# Altium project LPL_Control_board_Rev4.PrjPcb (part 1 of 2)
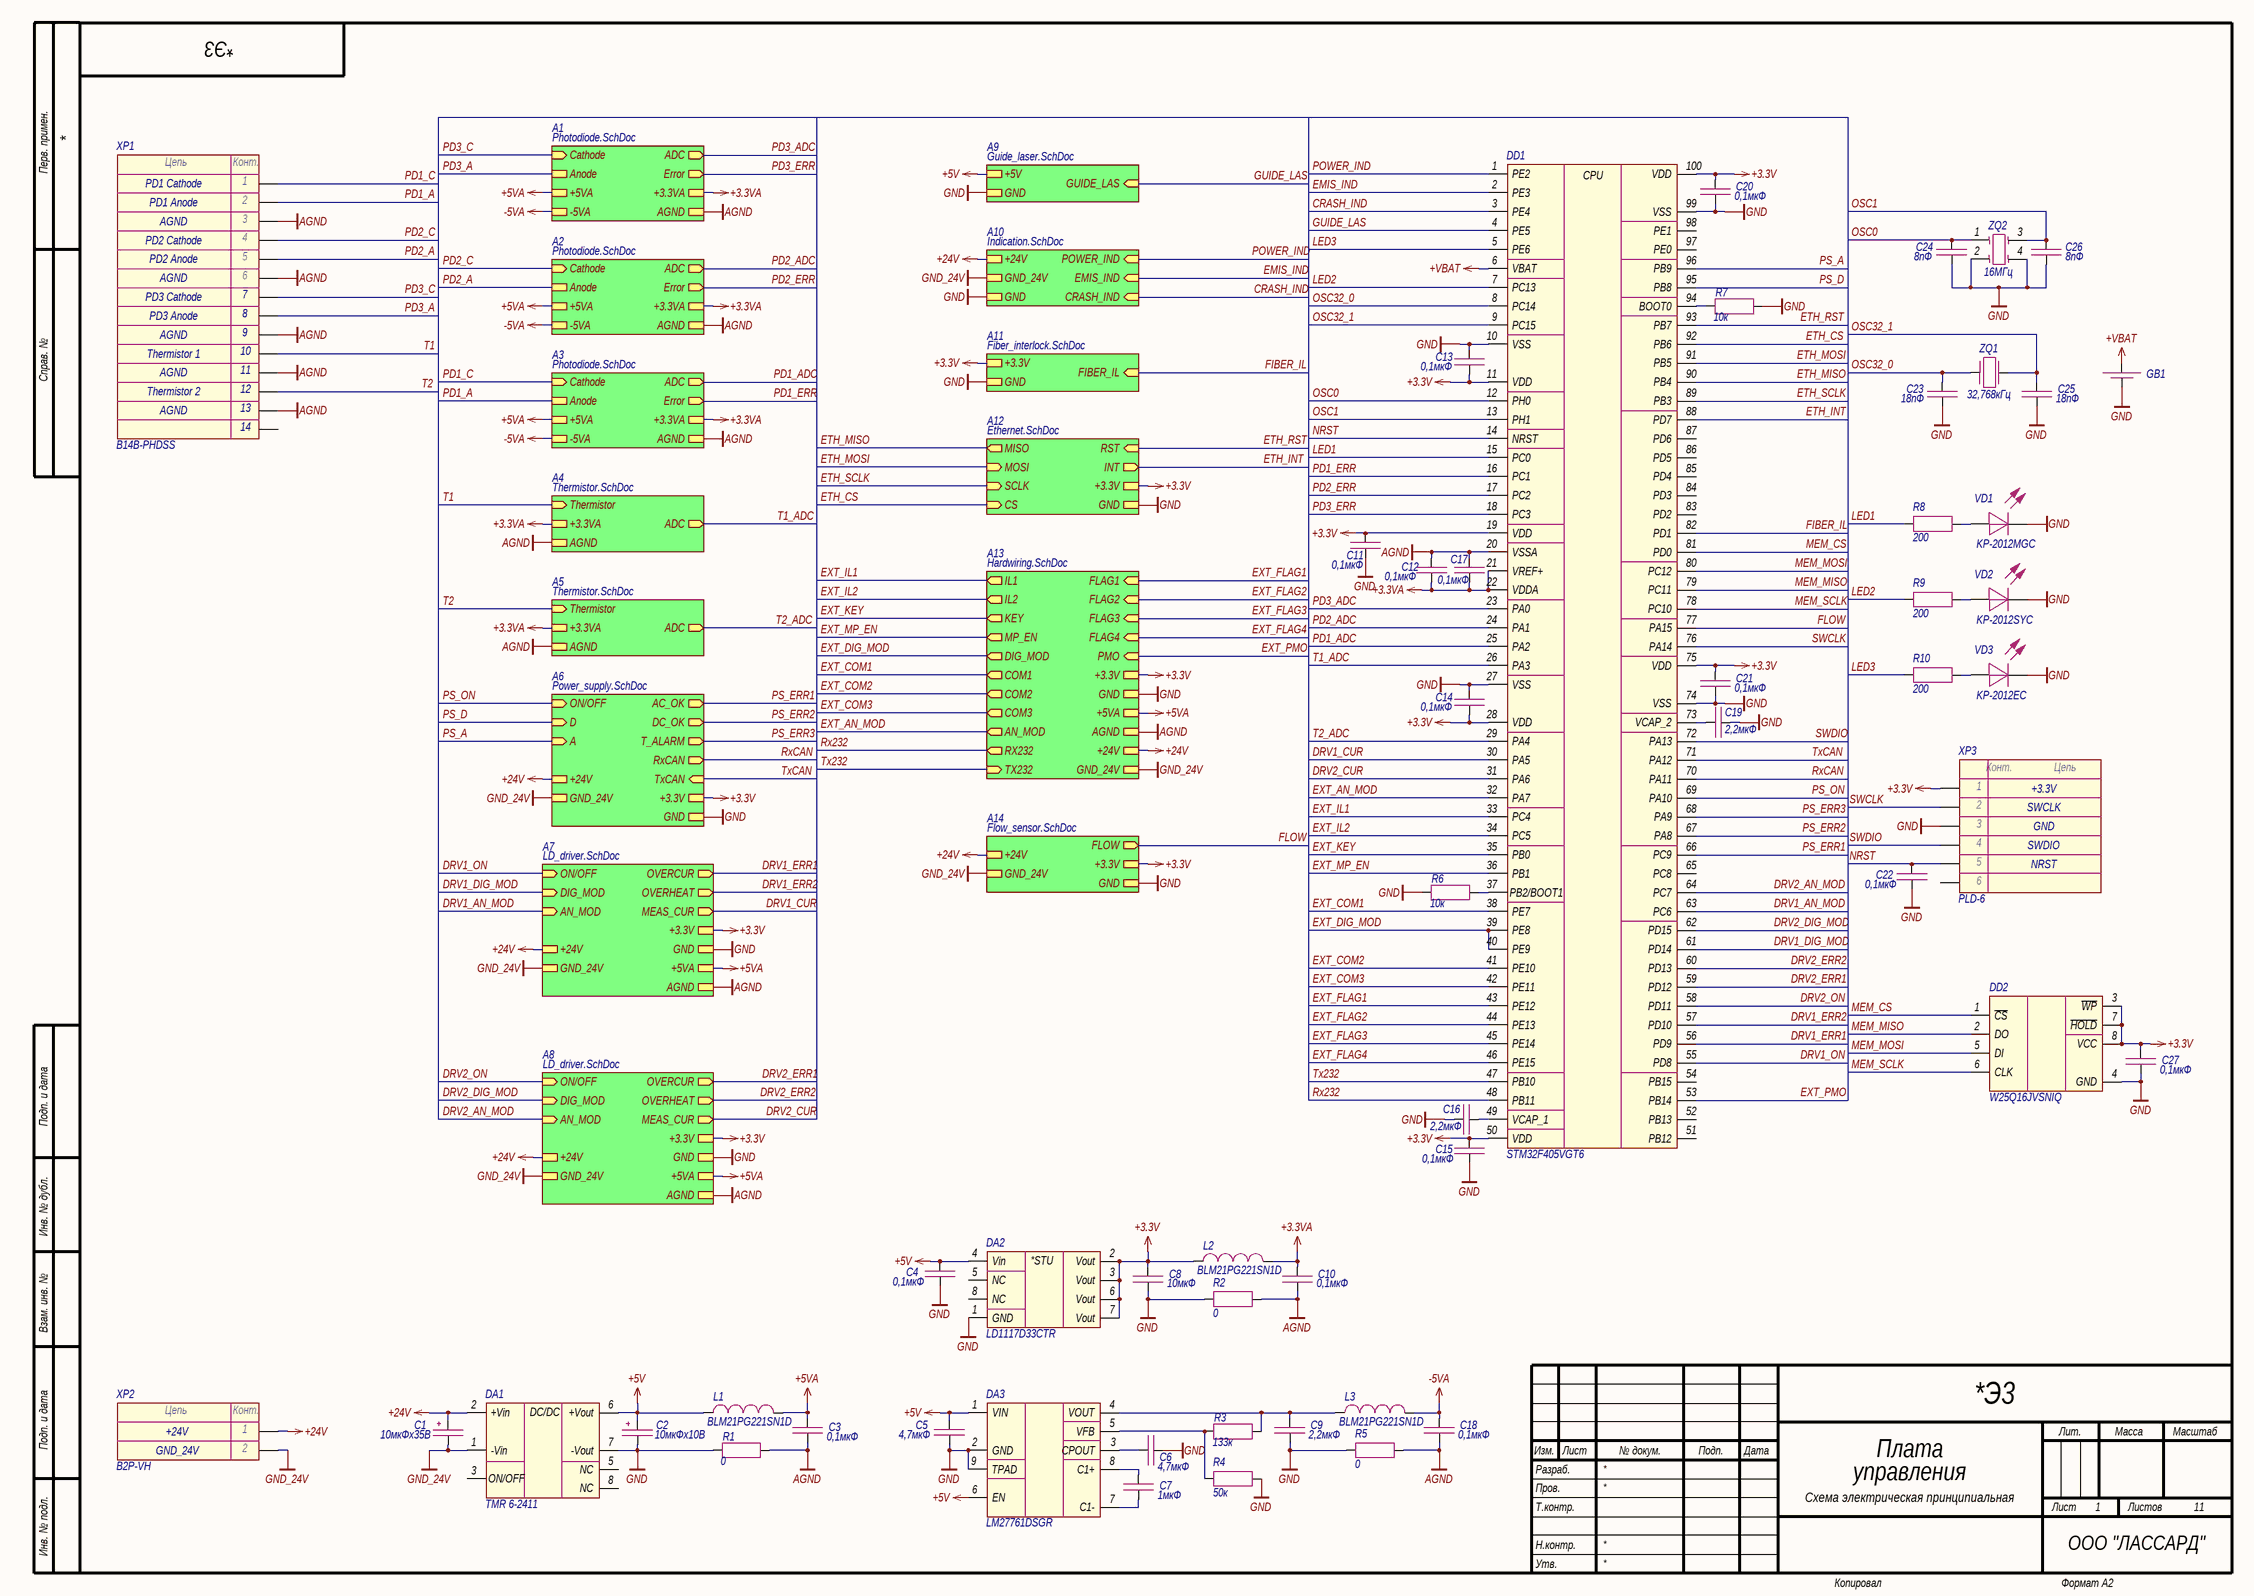
[diagram p0: Main.SchDoc]
11 sheets, 404 parts. Net scope: strictly hierarchical (ports join the sheet entries above them; power ports are local).
Board file: PCB1.PcbDoc
Sheets:
  Main.SchDoc
    A10 = Indication.SchDoc
    A13 = Hardwiring.SchDoc
    A12 = Ethernet.SchDoc
    A1 = Photodiode.SchDoc
    A4 = Thermistor.SchDoc
    A6 = Power_supply.SchDoc
    A7 = LD_driver.SchDoc
    A9 = Guide_laser.SchDoc
    A2 = Photodiode.SchDoc
    A5 = Thermistor.SchDoc
    A11 = Fiber_interlock.SchDoc
    A3 = Photodiode.SchDoc
    A14 = Flow_sensor.SchDoc
    A8 = LD_driver.SchDoc

## Sheet Main.SchDoc: Плата
size 594 x 420 mm; CompanyName: ООО "ЛАССАРД"; Address1: Address1; Address2: Address2; Address3: Address3; Address4: Address4; DocumentNumber: *Э3; SheetNumber: 1; SheetTotal: 11; Title2str: управления; DocumentType: Схема электрическая принципиальная

### Parts
C1  10мкФх35B  [CAP_C]
C2  10мкФх10B  [CAP_A]
C3  0,1мкФ  [CAP_0603]
C4  0,1мкФ  [CAP_0603]
C5  4,7мкФ  [CAP_0603]
C6  4,7мкФ  [CAP_0603]
C7  1мкФ  [CAP_0603]
C8  10мкФ  [CAP_0603]
C9  2,2мкФ  [CAP_0603]
C10  0,1мкФ  [CAP_0603]
C11  0,1мкФ  [CAP_0603]
C12  0,1мкФ  [CAP_0603]
C13  0,1мкФ  [CAP_0603]
C14  0,1мкФ  [CAP_0603]
C15  0,1мкФ  [CAP_0603]
C16  2,2мкФ  [CAP_0603]
C17  0,1мкФ  [CAP_0603]
C18  0,1мкФ  [CAP_0603]
C19  2,2мкФ  [CAP_0603]
C20  0,1мкФ  [CAP_0603]
C21  0,1мкФ  [CAP_0603]
C22  0,1мкФ  [CAP_0603]
C23  18пФ  [CAP_0603]
C24  8пФ  [CAP_0603]
C25  18пФ  [CAP_0603]
C26  8пФ  [CAP_0603]
C27  0,1мкФ  [CAP_0603]
DA1  TMR 6-2411  [TMR3 (SIP-8)]
DA2  LD1117D33CTR  [SOIC-8]
DA3  LM27761DSGR  [WSON-8]
DD1  STM32F405VGT6  [LQFP-100]
DD2  W25Q16JVSNIQ  [SOIC-8]
GB1  DS1092-12-N8S  [DS1092-12-N8S]  (value not drawn)
L1  BLM21PG221SN1D  [IND_0805]
L2  BLM21PG221SN1D  [IND_0805]
L3  BLM21PG221SN1D  [IND_0805]
R1  0  [RES_0805]
R2  0  [RES_0805]
R3  133к  [RES_0603]
R4  50к  [RES_0603]
R5  0  [RES_0805]
R6  10к  [RES_0603]
R7  10к  [RES_0603]
R8  200  [RES_0603]
R9  200  [RES_0603]
R10  200  [RES_0603]
VD1  KP-2012MGC  [LED_0805]
VD2  KP-2012SYC  [LED_0805]
VD3  KP-2012EC  [LED_0805]
XP1  B14B-PHDSS  [B14B-PHDSS]
XP2  B2P-VH  [B2P-VH]
XP3  PLD-6  [PLD-6]
ZQ1  32,768кГц  [NX3215SA]
ZQ2  16МГц  [NX2520SA]

### Sub-sheets
A1 = Photodiode.SchDoc: Cathode (in), ADC (out), Error (out), AGND, +5VA, +3.3VA, -5VA, Anode
A2 = Photodiode.SchDoc: Cathode (in), ADC (out), Error (out), AGND, +5VA, +3.3VA, -5VA, Anode
A3 = Photodiode.SchDoc: Cathode (in), ADC (out), Error (out), AGND, +5VA, +3.3VA, -5VA, Anode
A4 = Thermistor.SchDoc: Thermistor (in), +3.3VA, AGND, ADC (out)
A5 = Thermistor.SchDoc: Thermistor (in), +3.3VA, AGND, ADC (out)
A6 = Power_supply.SchDoc: ON/OFF (in), D (in), +3.3V, GND, +24V, GND_24V, AC_OK (out), DC_OK (out), RxCAN (out), TxCAN (in), T_ALARM (out), A (in)
A7 = LD_driver.SchDoc: +3.3V, GND, OVERCUR (out), OVERHEAT (out), +24V, GND_24V, ON/OFF (in), DIG_MOD (in), AN_MOD (in), MEAS_CUR (out), +5VA, AGND
A8 = LD_driver.SchDoc: +3.3V, GND, OVERCUR (out), OVERHEAT (out), +24V, GND_24V, ON/OFF (in), DIG_MOD (in), AN_MOD (in), MEAS_CUR (out), +5VA, AGND
A9 = Guide_laser.SchDoc: GUIDE_LAS (in), +5V, GND
A10 = Indication.SchDoc: GND_24V, +24V, CRASH_IND (in), POWER_IND (in), EMIS_IND (in), GND
A11 = Fiber_interlock.SchDoc: FIBER_IL (in), +3.3V, GND
A12 = Ethernet.SchDoc: MISO (out), RST (in), MOSI (in), INT (out), SCLK (in), CS (in), +3.3V, GND
A13 = Hardwiring.SchDoc: IL1 (out), FLAG1 (in), RX232 (out), TX232 (in), IL2 (out), KEY (out), MP_EN (out), AN_MOD (out), FLAG2 (in), FLAG3 (in), FLAG4 (in), PMO (in), COM1 (out), COM2 (out), COM3 (out), DIG_MOD (out), AGND, +3.3V, GND, GND_24V, +24V, +5VA
A14 = Flow_sensor.SchDoc: FLOW (out), +24V, GND_24V, +3.3V, GND

### Nets
+3.3V: C8.1 C11.1 C13.2 C14.2 C15.2 C20.1 C21.1 C27.1 DA2.2(Vout) DA2.3(Vout) DA2.6(Vout) DA2.7(Vout) DD1.11(VDD) DD1.19(VDD) DD1.28(VDD) DD1.50(VDD) DD1.75(VDD) DD1.100(VDD) DD2.3(~{WP}) DD2.7(~{HOLD}) DD2.8(VCC) L2.1 XP3.1 ; sheet A13/+3.3V, sheet A12/+3.3V, sheet A6/+3.3V, sheet A7/+3.3V, sheet A11/+3.3V, sheet A14/+3.3V, sheet A8/+3.3V
+3.3VA: C10.1 C12.2 C17.2 DD1.21(VREF+) DD1.22(VDDA) L2.2 ; sheet A1/+3.3VA, sheet A4/+3.3VA, sheet A2/+3.3VA, sheet A5/+3.3VA, sheet A3/+3.3VA
+5V: C2.1 C4.2 C5.1 DA1.6(+Vout) DA2.4(Vin) DA3.1(VIN) DA3.6(EN) L1.1 ; sheet A9/+5V
+5VA: C3.1 L1.2 ; sheet A13/+5VA, sheet A1/+5VA, sheet A7/+5VA, sheet A2/+5VA, sheet A3/+5VA, sheet A8/+5VA
+24V: C1.1 DA1.2(+Vin) XP2.1 ; sheet A10/+24V, sheet A13/+24V, sheet A6/+24V, sheet A7/+24V, sheet A14/+24V, sheet A8/+24V
+VBAT: DD1.6(VBAT) GB1.2
-5VA: C18.1 L3.2 ; sheet A1/-5VA, sheet A2/-5VA, sheet A3/-5VA
AGND: C3.2 C10.2 C12.1 C17.1 C18.2 DD1.20(VSSA) R1.2 R2.2 R5.2 XP1.3 XP1.6 XP1.9 XP1.11 XP1.13 ; sheet A13/AGND, sheet A1/AGND, sheet A4/AGND, sheet A7/AGND, sheet A2/AGND, sheet A5/AGND, sheet A3/AGND, sheet A8/AGND
GND: C2.2 C4.1 C5.2 C6.2 C8.2 C9.2 C11.2 C13.1 C14.1 C15.1 C16.2 C19.2 C20.2 C21.2 C22.2 C23.2 C24.2 C25.2 C26.2 C27.2 DA1.7(-Vout) DA2.1(GND) DA3.2(GND) DA3.9(TPAD) DD1.10(VSS) DD1.27(VSS) DD1.74(VSS) DD1.99(VSS) DD2.4(GND) GB1.1 R1.1 R2.1 R4.1 R5.1 R6.2 R7.2 VD1.2(C) VD2.2(C) VD3.2(C) XP3.3 ZQ2.2 ZQ2.4 ; sheet A10/GND, sheet A13/GND, sheet A12/GND, sheet A6/GND, sheet A7/GND, sheet A9/GND, sheet A11/GND, sheet A14/GND, sheet A8/GND
GND_24V: C1.2 DA1.1(-Vin) XP2.2 ; sheet A10/GND_24V, sheet A13/GND_24V, sheet A6/GND_24V, sheet A7/GND_24V, sheet A14/GND_24V, sheet A8/GND_24V
CRASH_IND: DD1.3(PE4) ; sheet A10/CRASH_IND
DRV1_AN_MOD: DD1.63(PC6) ; sheet A7/AN_MOD
DRV1_CUR: DD1.30(PA5) ; sheet A7/MEAS_CUR
DRV1_DIG_MOD: DD1.61(PD14) ; sheet A7/DIG_MOD
DRV1_ERR1: DD1.56(PD9) ; sheet A7/OVERCUR
DRV1_ERR2: DD1.57(PD10) ; sheet A7/OVERHEAT
DRV1_ON: DD1.55(PD8) ; sheet A7/ON/OFF
DRV2_AN_MOD: DD1.64(PC7) ; sheet A8/AN_MOD
DRV2_CUR: DD1.31(PA6) ; sheet A8/MEAS_CUR
DRV2_DIG_MOD: DD1.62(PD15) ; sheet A8/DIG_MOD
DRV2_ERR1: DD1.59(PD12) ; sheet A8/OVERCUR
DRV2_ERR2: DD1.60(PD13) ; sheet A8/OVERHEAT
DRV2_ON: DD1.58(PD11) ; sheet A8/ON/OFF
EMIS_IND: DD1.2(PE3) ; sheet A10/EMIS_IND
ETH_CS: DD1.92(PB6) ; sheet A12/CS
ETH_INT: DD1.88(PD7) ; sheet A12/INT
ETH_MISO: DD1.90(PB4) ; sheet A12/MISO
ETH_MOSI: DD1.91(PB5) ; sheet A12/MOSI
ETH_RST: DD1.93(PB7) ; sheet A12/RST
ETH_SCLK: DD1.89(PB3) ; sheet A12/SCLK
EXT_AN_MOD: DD1.32(PA7) ; sheet A13/AN_MOD
EXT_COM1: DD1.38(PE7) ; sheet A13/COM1
EXT_COM2: DD1.41(PE10) ; sheet A13/COM2
EXT_COM3: DD1.42(PE11) ; sheet A13/COM3
EXT_DIG_MOD: DD1.39(PE8) DD1.40(PE9) ; sheet A13/DIG_MOD
EXT_FLAG1: DD1.43(PE12) ; sheet A13/FLAG1
EXT_FLAG2: DD1.44(PE13) ; sheet A13/FLAG2
EXT_FLAG3: DD1.45(PE14) ; sheet A13/FLAG3
EXT_FLAG4: DD1.46(PE15) ; sheet A13/FLAG4
EXT_IL1: DD1.33(PC4) ; sheet A13/IL1
EXT_IL2: DD1.34(PC5) ; sheet A13/IL2
EXT_KEY: DD1.35(PB0) ; sheet A13/KEY
EXT_MP_EN: DD1.36(PB1) ; sheet A13/MP_EN
EXT_PMO: DD1.53(PB14) ; sheet A13/PMO
FIBER_IL: DD1.82(PD1) ; sheet A11/FIBER_IL
FLOW: DD1.77(PA15) ; sheet A14/FLOW
GUIDE_LAS: DD1.4(PE5) ; sheet A9/GUIDE_LAS
LED1: DD1.15(PC0) R8.1
LED2: DD1.7(PC13) R9.1
LED3: DD1.5(PE6) R10.1
MEM_CS: DD1.81(PD0) DD2.1(~{CS})
MEM_MISO: DD1.79(PC11) DD2.2(DO)
MEM_MOSI: DD1.80(PC12) DD2.5(DI)
MEM_SCLK: DD1.78(PC10) DD2.6(CLK)
NRST: C22.1 DD1.14(NRST) XP3.5
OSC0: C24.1 DD1.12(PH0) ZQ2.1
OSC1: C26.1 DD1.13(PH1) ZQ2.3
OSC32_0: C23.1 DD1.8(PC14) ZQ1.1
OSC32_1: C25.1 DD1.9(PC15) ZQ1.2
PD1_A: XP1.2 ; sheet A3/Anode
PD1_ADC: DD1.25(PA2) ; sheet A3/ADC
PD1_C: XP1.1 ; sheet A3/Cathode
PD1_ERR: DD1.16(PC1) ; sheet A3/Error
PD2_A: XP1.5 ; sheet A2/Anode
PD2_ADC: DD1.24(PA1) ; sheet A2/ADC
PD2_C: XP1.4 ; sheet A2/Cathode
PD2_ERR: DD1.17(PC2) ; sheet A2/Error
PD3_A: XP1.8 ; sheet A1/Anode
PD3_ADC: DD1.23(PA0) ; sheet A1/ADC
PD3_C: XP1.7 ; sheet A1/Cathode
PD3_ERR: DD1.18(PC3) ; sheet A1/Error
POWER_IND: DD1.1(PE2) ; sheet A10/POWER_IND
PS_A: DD1.96(PB9) ; sheet A6/A
PS_D: DD1.95(PB8) ; sheet A6/D
PS_ERR1: DD1.66(PC9) ; sheet A6/AC_OK
PS_ERR2: DD1.67(PA8) ; sheet A6/DC_OK
PS_ERR3: DD1.68(PA9) ; sheet A6/T_ALARM
PS_ON: DD1.69(PA10) ; sheet A6/ON/OFF
Rx232: DD1.48(PB11) ; sheet A13/RX232
RxCAN: DD1.70(PA11) ; sheet A6/RxCAN
SWCLK: DD1.76(PA14) XP3.2
SWDIO: DD1.72(PA13) XP3.4
T1: XP1.10 ; sheet A4/Thermistor
T1_ADC: DD1.26(PA3) ; sheet A4/ADC
T2: XP1.12 ; sheet A5/Thermistor
T2_ADC: DD1.29(PA4) ; sheet A5/ADC
Tx232: DD1.47(PB10) ; sheet A13/TX232
TxCAN: DD1.71(PA12) ; sheet A6/TxCAN
NetC6_1: C6.1 DA3.3(CPOUT)
NetC7_1: C7.1 DA3.8(C1+)
NetC7_2: C7.2 DA3.7(C1-)
NetC9_1: C9.1 DA3.4(VOUT) L3.1 R3.2
NetC16_1: C16.1 DD1.49(VCAP_1)
NetC19_1: C19.1 DD1.73(VCAP_2)
NetDA3_5: DA3.5(VFB) R3.1 R4.2
NetDD1_37: DD1.37(PB2/BOOT1) R6.1
NetDD1_94: DD1.94(BOOT0) R7.1
NetR8_2: R8.2 VD1.1(A)
NetR9_2: R9.2 VD2.1(A)
NetR10_2: R10.2 VD3.1(A)

Not connected (* = marked no-connect by the designer): DA1 3(ON/OFF) 5(NC) 8(NC); DA2 5(NC) 8(NC); DD1 51(PB12) 52(PB13) 54(PB15) 65(PC8) 83(PD2) 84(PD3) 85(PD4) 86(PD5) 87(PD6) 97(PE0) 98(PE1); XP1 14; XP3 6

### Notes on the sheet
- PD1 Cathode
- PD1 Anode
- AGND
- PD2 Anode
- PD2 Cathode
- PD3 Anode
- PD3 Cathode
- Thermistor 1
- Thermistor 2
- +3.3V
- SWCLK
- GND
- SWDIO
- NRST
- +24V
- GND_24V
- Перв. примен.
- Справ. №
- Подп. и дата
- Инв. № дубл.
- Взам. инв. №
- Разраб.
- Изм.
- Лист
- № докум.
- Подп.
- Дата
- Лит.
- Масса
- Масштаб
- Пров.
- Т.контр.
- Листов
- Инв. № подл.
- Утв.
- Н.контр.
- Копировал
- Формат А2
- (in symbol Connector-2) Цепь; Конт.
- (in symbol Connector-14) Цепь; Конт.
- (in symbol LD1117D33) *STU
- (in symbol STM32F405VG) CPU
- (in symbol TMR3) DC/DC

### Library data of the parts
C1 = Capacitor_Polar: Model: TECAP, 10 мкФ, 35 В, тип C, 10%; Value: 10мкФх35B; Document: *; Manufacturer: *
C2 = Capacitor_Polar: Model: TECAP, 10 мкФ, 10 В, тип A, 10%; Value: 10мкФх10B; Document: *; Manufacturer: *
C3 C4 C10-C15 C17 C18 C20-C22 C27 = Capacitor: Manufacturer: Murata; Model: GRM188R71H104KA93D; Value: 0,1мкФ; Document: *
C5 C6 = Capacitor: Manufacturer: Murata; Model: GRM188R6YA475KE15D; Value: 4,7мкФ; Document: *
C7 = Capacitor: Manufacturer: Murata; Model: GRM188R61H105KAALD; Value: 1мкФ; Document: *
C8 = Capacitor: Manufacturer: Murata; Model: GRM188R61E106KA73D; Value: 10мкФ; Document: *
C9 C16 C19 = Capacitor: Manufacturer: Murata; Model: GRM188R61H225KE11D; Value: 2,2мкФ; Document: *
C23 C25 = Capacitor: Manufacturer: Murata; Model: GRM1885C1H180FA01D; Value: 18пФ; Document: *
C24 C26 = Capacitor: Manufacturer: Yageo; Model: CC0603CRNPO9BN8R0; Value: 8пФ; Document: *
DA1 = TMR3: Manufacturer: Traco Power; Model: TMR 6-2411; Document: *
DA2 = LD1117D33: Manufacturer: STMicroelectronics; Model: LD1117D33CTR; Document: *
DA3 = LM27761: Manufacturer: Texas Instruments; Model: LM27761DSGR; Document: *
DD1 = STM32F405VG: Manufacturer: STMicroelectronics; Model: STM32F405VGT6; Document: *
DD2 = W25Q: Manufacturer: Winbond; Model: W25Q16JVSNIQ; Document: *
GB1 = Accumulator: Manufacturer: Connfly; Model: DS1092-12-N8S; Document: *
L1-L3 = Inductor: Manufacturer: Murata; Value: *; Model: BLM21PG221SN1D; Document: *
R1 R2 R5 = Resistor: Manufacturer: Yageo; Model: RC0805FR-070RL; Value: 0; Document: *
R3 = Resistor: Manufacturer: Yageo; Model: RC0603FR-07133KL; Value: 133к; Document: *
R4 = Resistor: Manufacturer: Yageo; Model: RT0603BRD0750KL; Value: 50к; Document: *
R6 R7 = Resistor: Manufacturer: Yageo; Model: RC0603FR-0710KL; Value: 10к; Document: *
R8-R10 = Resistor: Manufacturer: Yageo; Model: RC0603FR-07200RL; Value: 200; Document: *
VD1-VD3 = LED: Manufacturer: Kingbright; Document: *
  VD1: Model: KP-2012MGC
  VD2: Model: KP-2012SYC
  VD3: Model: KP-2012EC
XP1 = Connector-14: Manufacturer: JST; Model: B14B-PHDSS; Document: *
XP2 = Connector-2: Manufacturer: JST; Model: B2P-VH; Document: *
XP3 = Connector-6: Manufacturer: Connfly; Model: PLD-6; Document: *
ZQ1 = Quartz_Resonator: Manufacturer: NDK; Model: NX3215SA- 32.768K-STD-MUA-8; Value: 32,768кГц; Document: *
ZQ2 = Quartz_Resonator_4-pin: Manufacturer: NDK; Model: NX2520SA-16MHZ-STD-CSW-5; Value: 16МГц; Document: *

## Sheet Indication.SchDoc
size 420 x 297 mm; Address1: Address1; Address2: Address2; Address3: Address3; Address4: Address4; DocumentNumber: *Э3; SheetNumber: 7; SheetTotal: 11; DocumentType: Схема электрическая *
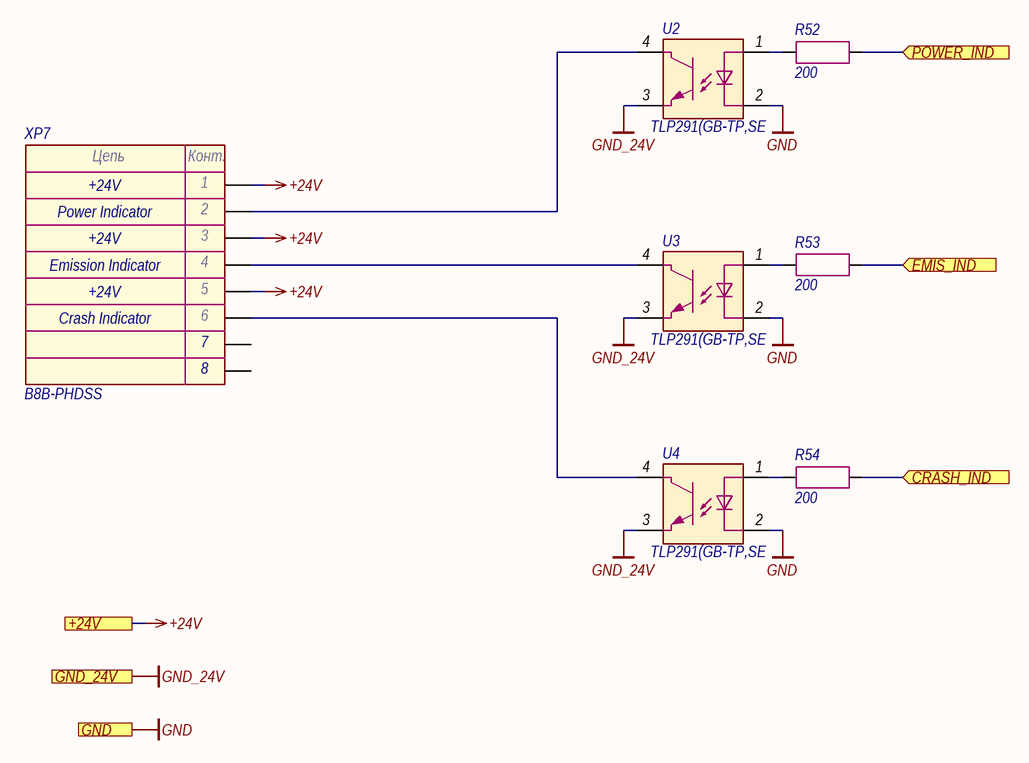
[diagram p1: Indication.SchDoc]

### Parts
R52  200  [RES_0603]
R53  200  [RES_0603]
R54  200  [RES_0603]
U2  TLP291(GB-TP,SE  [11-3C1]
U3  TLP291(GB-TP,SE  [11-3C1]
U4  TLP291(GB-TP,SE  [11-3C1]
XP7  B8B-PHDSS  [B8B-PHDSS]

### Ports
+24V (see Main[2A], Flow_sensor[2C], Hardwiring[3C], LD_driver[1D], Power_supply[1D]), CRASH_IND (in, see Main[3A]), EMIS_IND (in, see Main[3A]), GND (see Main[2A], Ethernet[3D], Fiber_interlock[2C], Flow_sensor[2C], Guide_laser[1C], Hardwiring[3D], LD_driver[1D], Power_supply[1D]), GND_24V (see Main[2A], Flow_sensor[2C], Hardwiring[3C], LD_driver[1D], Power_supply[1D]), POWER_IND (in, see Main[3A])

### Nets
+24V: XP7.1 XP7.3 XP7.5 ; port +24V
GND: U2.2 U3.2 U4.2 ; port GND
GND_24V: U2.3 U3.3 U4.3 ; port GND_24V
CRASH_IND: R54.2 ; port CRASH_IND
EMIS_IND: R53.2 ; port EMIS_IND
POWER_IND: R52.2 ; port POWER_IND
NetR52_1: R52.1 U2.1
NetR53_1: R53.1 U3.1
NetR54_1: R54.1 U4.1
NetU2_4: U2.4 XP7.2
NetU3_4: U3.4 XP7.4
NetU4_4: U4.4 XP7.6

Not connected (* = marked no-connect by the designer): XP7 7 8

### Notes on the sheet
- Power Indicator
- +24V
- (near XP7) Emission Indicator
- Crash Indicator
- Подп. и дата
- Инв. № дубл.
- Взам. инв. №
- Инв. № подл.
- Изм.
- Лист
- № докум.
- Подп.
- Дата
- Копировал
- Формат А3
- (in symbol Connector-8) Цепь; Конт.

### Library data of the parts
R52-R54 = Resistor: as R8 on sheet Main; Value: 200; Document: *
U2-U4 = TLP291: Manufacturer: Toshiba; Model: TLP291(GB-TP,SE; Document: *
XP7 = Connector-8: Manufacturer: JST; Model: B8B-PHDSS; Document: *

## Sheet Hardwiring.SchDoc
size 594 x 420 mm; Address1: Address1; Address2: Address2; Address3: Address3; Address4: Address4; DocumentNumber: *Э3; SheetNumber: 10; SheetTotal: 11; DocumentType: Схема электрическая *
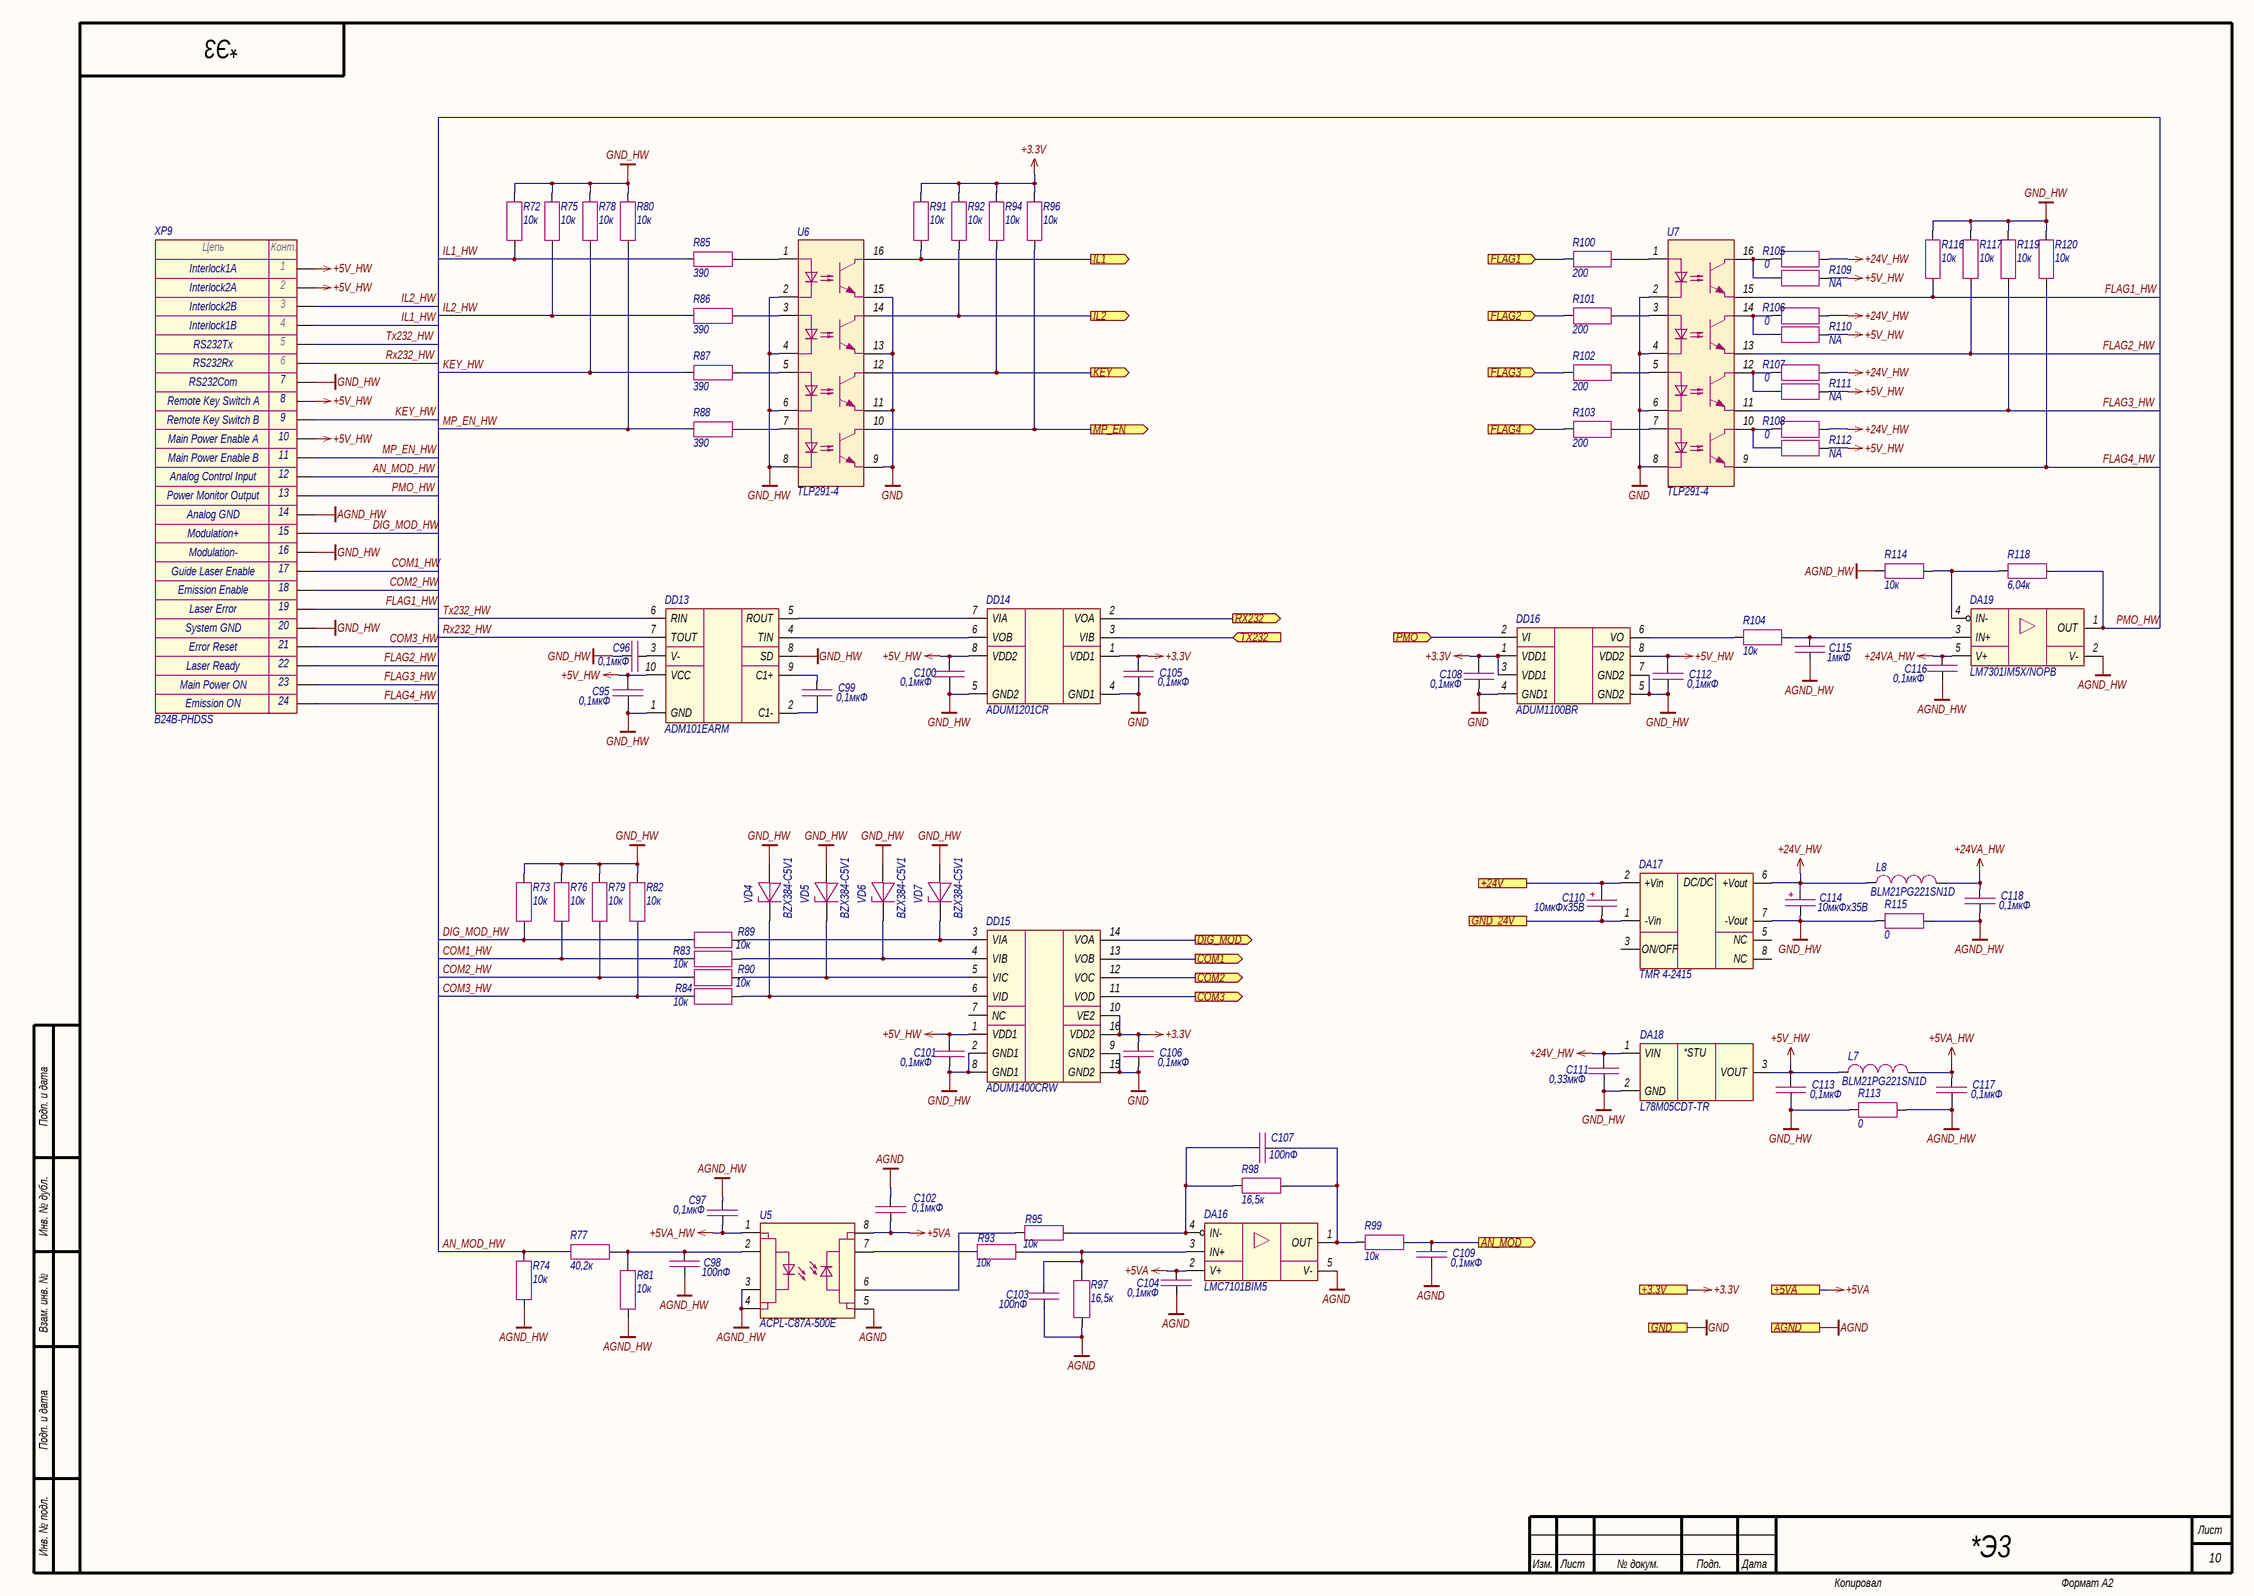
[diagram p2: Hardwiring.SchDoc]

### Parts
C95  0,1мкФ  [CAP_0603]
C96  0,1мкФ  [CAP_0603]
C97  0,1мкФ  [CAP_0603]
C98  100пФ  [CAP_0603]
C99  0,1мкФ  [CAP_0603]
C100  0,1мкФ  [CAP_0603]
C101  0,1мкФ  [CAP_0603]
C102  0,1мкФ  [CAP_0603]
C103  100пФ  [CAP_0603]
C104  0,1мкФ  [CAP_0603]
C105  0,1мкФ  [CAP_0603]
C106  0,1мкФ  [CAP_0603]
C107  100пФ  [CAP_0603]
C108  0,1мкФ  [CAP_0603]
C109  0,1мкФ  [CAP_0603]
C110  10мкФх35B  [CAP_C]
C111  0,33мкФ  [CAP_0805]
C112  0,1мкФ  [CAP_0603]
C113  0,1мкФ  [CAP_0603]
C114  10мкФх35B  [CAP_C]
C115  1мкФ  [CAP_0603]
C116  0,1мкФ  [CAP_0603]
C117  0,1мкФ  [CAP_0603]
C118  0,1мкФ  [CAP_0603]
DA16  LMC7101BIM5  [SOT-23-5]
DA17  TMR 4-2415  [TMR4 (SIP-8)]
DA18  L78M05CDT-TR  [TO-252]
DA19  LM7301IM5X/NOPB  [SOT-23-5]
DD13  ADM101EARM  [MSOP-10]
DD14  ADUM1201CR  [SOIC-8]
DD15  ADUM1400CRW  [SOIC-16W]
DD16  ADUM1100BR  [SOIC-8]
L7  BLM21PG221SN1D  [IND_0805]
L8  BLM21PG221SN1D  [IND_0805]
R72  10к  [RES_0603]
R73  10к  [RES_0603]
R74  10к  [RES_0603]
R75  10к  [RES_0603]
R76  10к  [RES_0603]
R77  40,2к  [RES_0603]
R78  10к  [RES_0603]
R79  10к  [RES_0603]
R80  10к  [RES_0603]
R81  10к  [RES_0603]
R82  10к  [RES_0603]
R83  10к  [RES_0603]
R84  10к  [RES_0603]
R85  390  [RES_0603]
R86  390  [RES_0603]
R87  390  [RES_0603]
R88  390  [RES_0603]
R89  10к  [RES_0603]
R90  10к  [RES_0603]
R91  10к  [RES_0603]
R92  10к  [RES_0603]
R93  10к  [RES_0603]
R94  10к  [RES_0603]
R95  10к  [RES_0603]
R96  10к  [RES_0603]
R97  16,5к  [RES_0603]
R98  16,5к  [RES_0603]
R99  10к  [RES_0603]
R100  200  [RES_0603]
R101  200  [RES_0603]
R102  200  [RES_0603]
R103  200  [RES_0603]
R104  10к  [RES_0603]
R105  0  [RES_0603]
R106  0  [RES_0603]
R107  0  [RES_0603]
R108  0  [RES_0603]
R109  NA  [RES_0603]
R110  NA  [RES_0603]
R111  NA  [RES_0603]
R112  NA  [RES_0603]
R113  0  [RES_0805]
R114  10к  [RES_0603]
R115  0  [RES_0805]
R116  10к  [RES_0603]
R117  10к  [RES_0603]
R118  6,04к  [RES_0603]
R119  10к  [RES_0603]
R120  10к  [RES_0603]
U5  ACPL-C87A-500E  [SSO-8]
U6  TLP291-4  [SOP-16]
U7  TLP291-4  [SOP-16]
VD4  BZX384-C5V1  [SOD-323]
VD5  BZX384-C5V1  [SOD-323]
VD6  BZX384-C5V1  [SOD-323]
VD7  BZX384-C5V1  [SOD-323]
XP9  B24B-PHDSS  [B24B-PHDSS]

### Ports
+3.3V (see Main[3B], Ethernet[3D], Fiber_interlock[2C], Flow_sensor[2C], LD_driver[1D], Power_supply[1D]), +5VA (see Main[3B], LD_driver[1D], Photodiode[1C]), +24V (see Main[3B], Flow_sensor[2C], Indication[1C], LD_driver[1D], Power_supply[1D]), AGND (see Main[3B], LD_driver[1D], Photodiode[1D], Thermistor[2C]), AN_MOD (out, see Main[2B]), COM1 (out, see Main[2B]), COM2 (out, see Main[2B]), COM3 (out, see Main[2B]), DIG_MOD (out, see Main[2B]), FLAG1 (in, see Main[3B]), FLAG2 (in, see Main[3B]), FLAG3 (in, see Main[3B]), FLAG4 (in, see Main[3B]), GND (see Main[3B], Ethernet[3D], Fiber_interlock[2C], Flow_sensor[2C], Guide_laser[1C], Indication[1C], LD_driver[1D], Power_supply[1D]), GND_24V (see Main[3B], Flow_sensor[2C], Indication[1C], LD_driver[1D], Power_supply[1D]), IL1 (out, see Main[2B]), IL2 (out, see Main[2B]), KEY (out, see Main[2B]), MP_EN (out, see Main[2B]), PMO (in, see Main[3B]), RX232 (out, see Main[2B]), TX232 (in, see Main[2B])

### Nets
+3.3V: C105.1 C106.1 C108.1 DD14.1(VDD1) DD15.10(VE2) DD15.16(VDD2) DD16.1(VDD1) DD16.3(VDD1) R91.1 R92.1 R94.1 R96.1 ; port +3.3V
+5V_HW: C95.1 C100.1 C101.1 C112.1 C113.1 DA18.3(VOUT) DD13.10(VCC) DD14.8(VDD2) DD15.1(VDD1) DD16.8(VDD2) L7.1 R109.2 R110.2 R111.2 R112.2 XP9.1 XP9.2 XP9.8 XP9.10
+5VA: C102.1 C104.1 DA16.2(V+) U5.8(VDD2) ; port +5VA
+5VA_HW: C97.1 C117.1 L7.2 U5.1(VDD1)
+24V: C110.1 DA17.2(+Vin) ; port +24V
+24V_HW: C111.2 C114.1 DA17.6(+Vout) DA18.1(VIN) L8.1 R105.2 R106.2 R107.2 R108.2
+24VA_HW: C116.1 C118.1 DA19.5(V+) L8.2
AGND: C102.2 C103.2 C104.2 C109.2 DA16.5(V-) R97.2 U5.5(GND2) ; port AGND
AGND_HW: C97.2 C98.1 C115.2 C116.2 C117.2 C118.2 DA19.2(V-) R74.2 R81.2 R113.2 R114.1 R115.2 U5.3(SHDN) U5.4(GND1) XP9.14
GND: C105.2 C106.2 C108.2 DD14.4(GND1) DD15.9(GND2) DD15.15(GND2) DD16.4(GND1) U6.9 U6.11 U6.13 U6.15 U7.2 U7.4 U7.6 U7.8 ; port GND
GND_24V: C110.2 DA17.1(-Vin) ; port GND_24V
GND_HW: C95.2 C96.2 C100.2 C101.2 C111.1 C112.2 C113.2 C114.2 DA17.7(-Vout) DA18.2(GND) DD13.1(GND) DD13.8(SD) DD14.5(GND2) DD15.2(GND1) DD15.8(GND1) DD16.5(GND2) DD16.7(GND2) R72.1 R73.1 R75.1 R76.1 R78.1 R79.1 R80.1 R82.1 R113.1 R115.1 R116.1 R117.1 R119.1 R120.1 U6.2 U6.4 U6.6 U6.8 VD4.2(A) VD5.2(A) VD6.2(A) VD7.2(A) XP9.7 XP9.16 XP9.20
AN_MOD_HW: R74.1 R77.2 XP9.12
COM1_HW: R76.2 R83.1 XP9.17
COM2_HW: R79.2 R90.1 XP9.18
COM3_HW: R82.2 R84.1 XP9.21
DIG_MOD_HW: R73.2 R89.1 XP9.15
EXT_AN_MOD: C109.1 R99.2 ; port AN_MOD
EXT_COM1: DD15.13(VOB) ; port COM1
EXT_COM2: DD15.12(VOC) ; port COM2
EXT_COM3: DD15.11(VOD) ; port COM3
EXT_DIG_MOD: DD15.14(VOA) ; port DIG_MOD
EXT_FLAG1: R100.2 ; port FLAG1
EXT_FLAG2: R101.2 ; port FLAG2
EXT_FLAG3: R102.2 ; port FLAG3
EXT_FLAG4: R103.2 ; port FLAG4
EXT_IL1: R91.2 U6.16 ; port IL1
EXT_IL2: R92.2 U6.14 ; port IL2
EXT_KEY: R94.2 U6.12 ; port KEY
EXT_MP_EN: R96.2 U6.10 ; port MP_EN
EXT_PMO: DD16.2(VI) ; port PMO
FLAG1_HW: R116.2 U7.15 XP9.19
FLAG2_HW: R117.2 U7.13 XP9.22
FLAG3_HW: R119.2 U7.11 XP9.23
FLAG4_HW: R120.2 U7.9 XP9.24
IL1_HW: R72.2 R85.1 XP9.4
IL2_HW: R75.2 R86.1 XP9.3
KEY_HW: R78.2 R87.1 XP9.9
MP_EN_HW: R80.2 R88.1 XP9.11
PMO_HW: DA19.1(OUT) R118.2 XP9.13
Rx232: DD14.2(VOA) ; port RX232
Rx232_HW: DD13.7(TOUT) XP9.6
Tx232: DD14.3(VIB) ; port TX232
Tx232_HW: DD13.6(RIN) XP9.5
NetC96_1: C96.1 DD13.3(V-)
NetC98_2: C98.2 R77.1 R81.1 U5.2(VIN)
NetC99_1: C99.1 DD13.9(C1+)
NetC99_2: C99.2 DD13.2(C1-)
NetC103_1: C103.1 DA16.3(IN+) R93.2 R97.1
NetC107_1: C107.1 DA16.4(IN-) R95.2 R98.2
NetC107_2: C107.2 DA16.1(OUT) R98.1 R99.1
NetC115_1: C115.1 DA19.3(IN+) R104.2
NetDA19_4: DA19.4(IN-) R114.2 R118.1
NetDD13_4: DD13.4(TIN) DD14.6(VOB)
NetDD13_5: DD13.5(ROUT) DD14.7(VIA)
NetDD15_3: DD15.3(VIA) R89.2 VD7.1(K)
NetDD15_4: DD15.4(VIB) R83.2 VD6.1(K)
NetDD15_5: DD15.5(VIC) R90.2 VD5.1(K)
NetDD15_6: DD15.6(VID) R84.2 VD4.1(K)
NetDD16_6: DD16.6(VO) R104.1
NetR85_2: R85.2 U6.1
NetR86_2: R86.2 U6.3
NetR87_2: R87.2 U6.5
NetR88_2: R88.2 U6.7
NetR93_1: R93.1 U5.7(VOUT+)
NetR95_1: R95.1 U5.6(VOUT-)
NetR100_1: R100.1 U7.1
NetR101_1: R101.1 U7.3
NetR102_1: R102.1 U7.5
NetR103_1: R103.1 U7.7
NetR105_1: R105.1 R109.1 U7.16
NetR106_1: R106.1 R110.1 U7.14
NetR107_1: R107.1 R111.1 U7.12
NetR108_1: R108.1 R112.1 U7.10

Not connected (* = marked no-connect by the designer): DA17 3(ON/OFF) 5(NC) 8(NC); DD15 7(NC)

### Notes on the sheet
- Interlock1A
- Interlock2A
- Interlock2B
- Interlock1B
- RS232Tx
- RS232Rx
- (near XP9) Remote Key Switch A
- RS232Com
- (near XP9) Remote Key Switch B
- (near XP9) Main Power Enable A
- (near XP9) Main Power Enable B
- (near XP9) Analog Control Input
- (near XP9) Power Monitor Output
- Analog GND
- Modulation+
- Modulation-
- (near XP9) Guide Laser Enable
- (near XP9) Emission Enable
- System GND
- Error Reset
- Laser Error
- Main Power ON
- Emission ON
- Laser Ready
- Подп. и дата
- Инв. № дубл.
- Взам. инв. №
- Инв. № подл.
- Изм.
- Лист
- № докум.
- Подп.
- Дата
- Копировал
- Формат А2
- (in symbol Connector-24) Цепь; Конт.
- (in symbol L78M) *STU
- (in symbol TMR4) DC/DC

### Library data of the parts
C95-C97 C99-C102 C104-C106 C108 C109 C112 C113 C116-C118 = Capacitor: as C3 on sheet Main; Value: 0,1мкФ; Document: *
C98 C103 C107 = Capacitor: Manufacturer: Murata; Model: GRM1885C1H101JA01D; Value: 100пФ; Document: *
C110 C114 = Capacitor_Polar: Model: TECAP, 10 мкФ, 35 В, тип C, 10%; Value: 10мкФх35B; Document: *; Manufacturer: *
C111 = Capacitor: Manufacturer: Murata; Model: GRM219R71H334KA88D; Value: 0,33мкФ; Document: *
C115 = Capacitor: as C7 on sheet Main; Value: 1мкФ; Document: *
DA16 = LMC7101: Manufacturer: Texas Instruments; Model: LMC7101BIM5; Document: *
DA17 = TMR4: Manufacturer: Traco Power; Model: TMR 4-2415; Document: *
DA18 = L78M: Manufacturer: STMicroelectronics; Model: L78M05CDT-TR; Document: *
DA19 = LM7301IM5: Manufacturer: Texas Instruments; Model: LM7301IM5X/NOPB; Document: *
DD13 = ADM101EARM: Manufacturer: Analog Devices; Model: ADM101EARM; Document: *
DD14 = ADUM1201: Manufacturer: Analog Devices; Model: ADUM1201CR; Document: *
DD15 = ADUM1400: Manufacturer: Analog Devices; Model: ADUM1400CRW; Document: *
DD16 = ADUM1100: Manufacturer: Analog Devices; Model: ADUM1100BR; Document: *
L7 L8 = Inductor: Manufacturer: Murata; Value: *; Model: BLM21PG221SN1D; Document: *
R72-R76 R78-R84 R89-R96 R99 R104 R114 R116 R117 R119 R120 = Resistor: as R6 on sheet Main; Value: 10к; Document: *
R77 = Resistor: Manufacturer: Yageo; Model: RC0603FR-0740K2L; Value: 40,2к; Document: *
R85-R88 = Resistor: Manufacturer: Yageo; Model: RC0603FR-07390RL; Value: 390; Document: *
R97 R98 = Resistor: Manufacturer: Yageo; Model: RC0603FR-0716K5L; Value: 16,5к; Document: *
R100-R103 = Resistor: as R8 on sheet Main; Value: 200; Document: *
R105-R108 = Resistor: Manufacturer: Yageo; Model: RC0603FR-070RL; Value: 0; Document: *
R109-R112 = Resistor: Value: NA; Model: *; Document: *; Manufacturer: *
R113 R115 = Resistor: as R1 on sheet Main; Value: 0; Document: *
R118 = Resistor: Manufacturer: Yageo; Model: RC0603FR-076K04L; Value: 6,04к; Document: *
U5 = ACPL-C87: Manufacturer: Broadcom; Model: ACPL-C87A-500E
U6 U7 = TLP281-4: Manufacturer: Toshiba; Model: TLP291-4; Document: *
VD4-VD7 = Diode_Zener: Manufacturer: Nexperia; Model: BZX384-C5V1; Document: *
XP9 = Connector-24: Manufacturer: JST; Model: B24B-PHDSS; Document: *

## Sheet Ethernet.SchDoc
size 420 x 297 mm; Address1: Address1; Address2: Address2; Address3: Address3; Address4: Address4; DocumentNumber: *Э3; SheetNumber: 9; SheetTotal: 11; DocumentType: Схема электрическая *
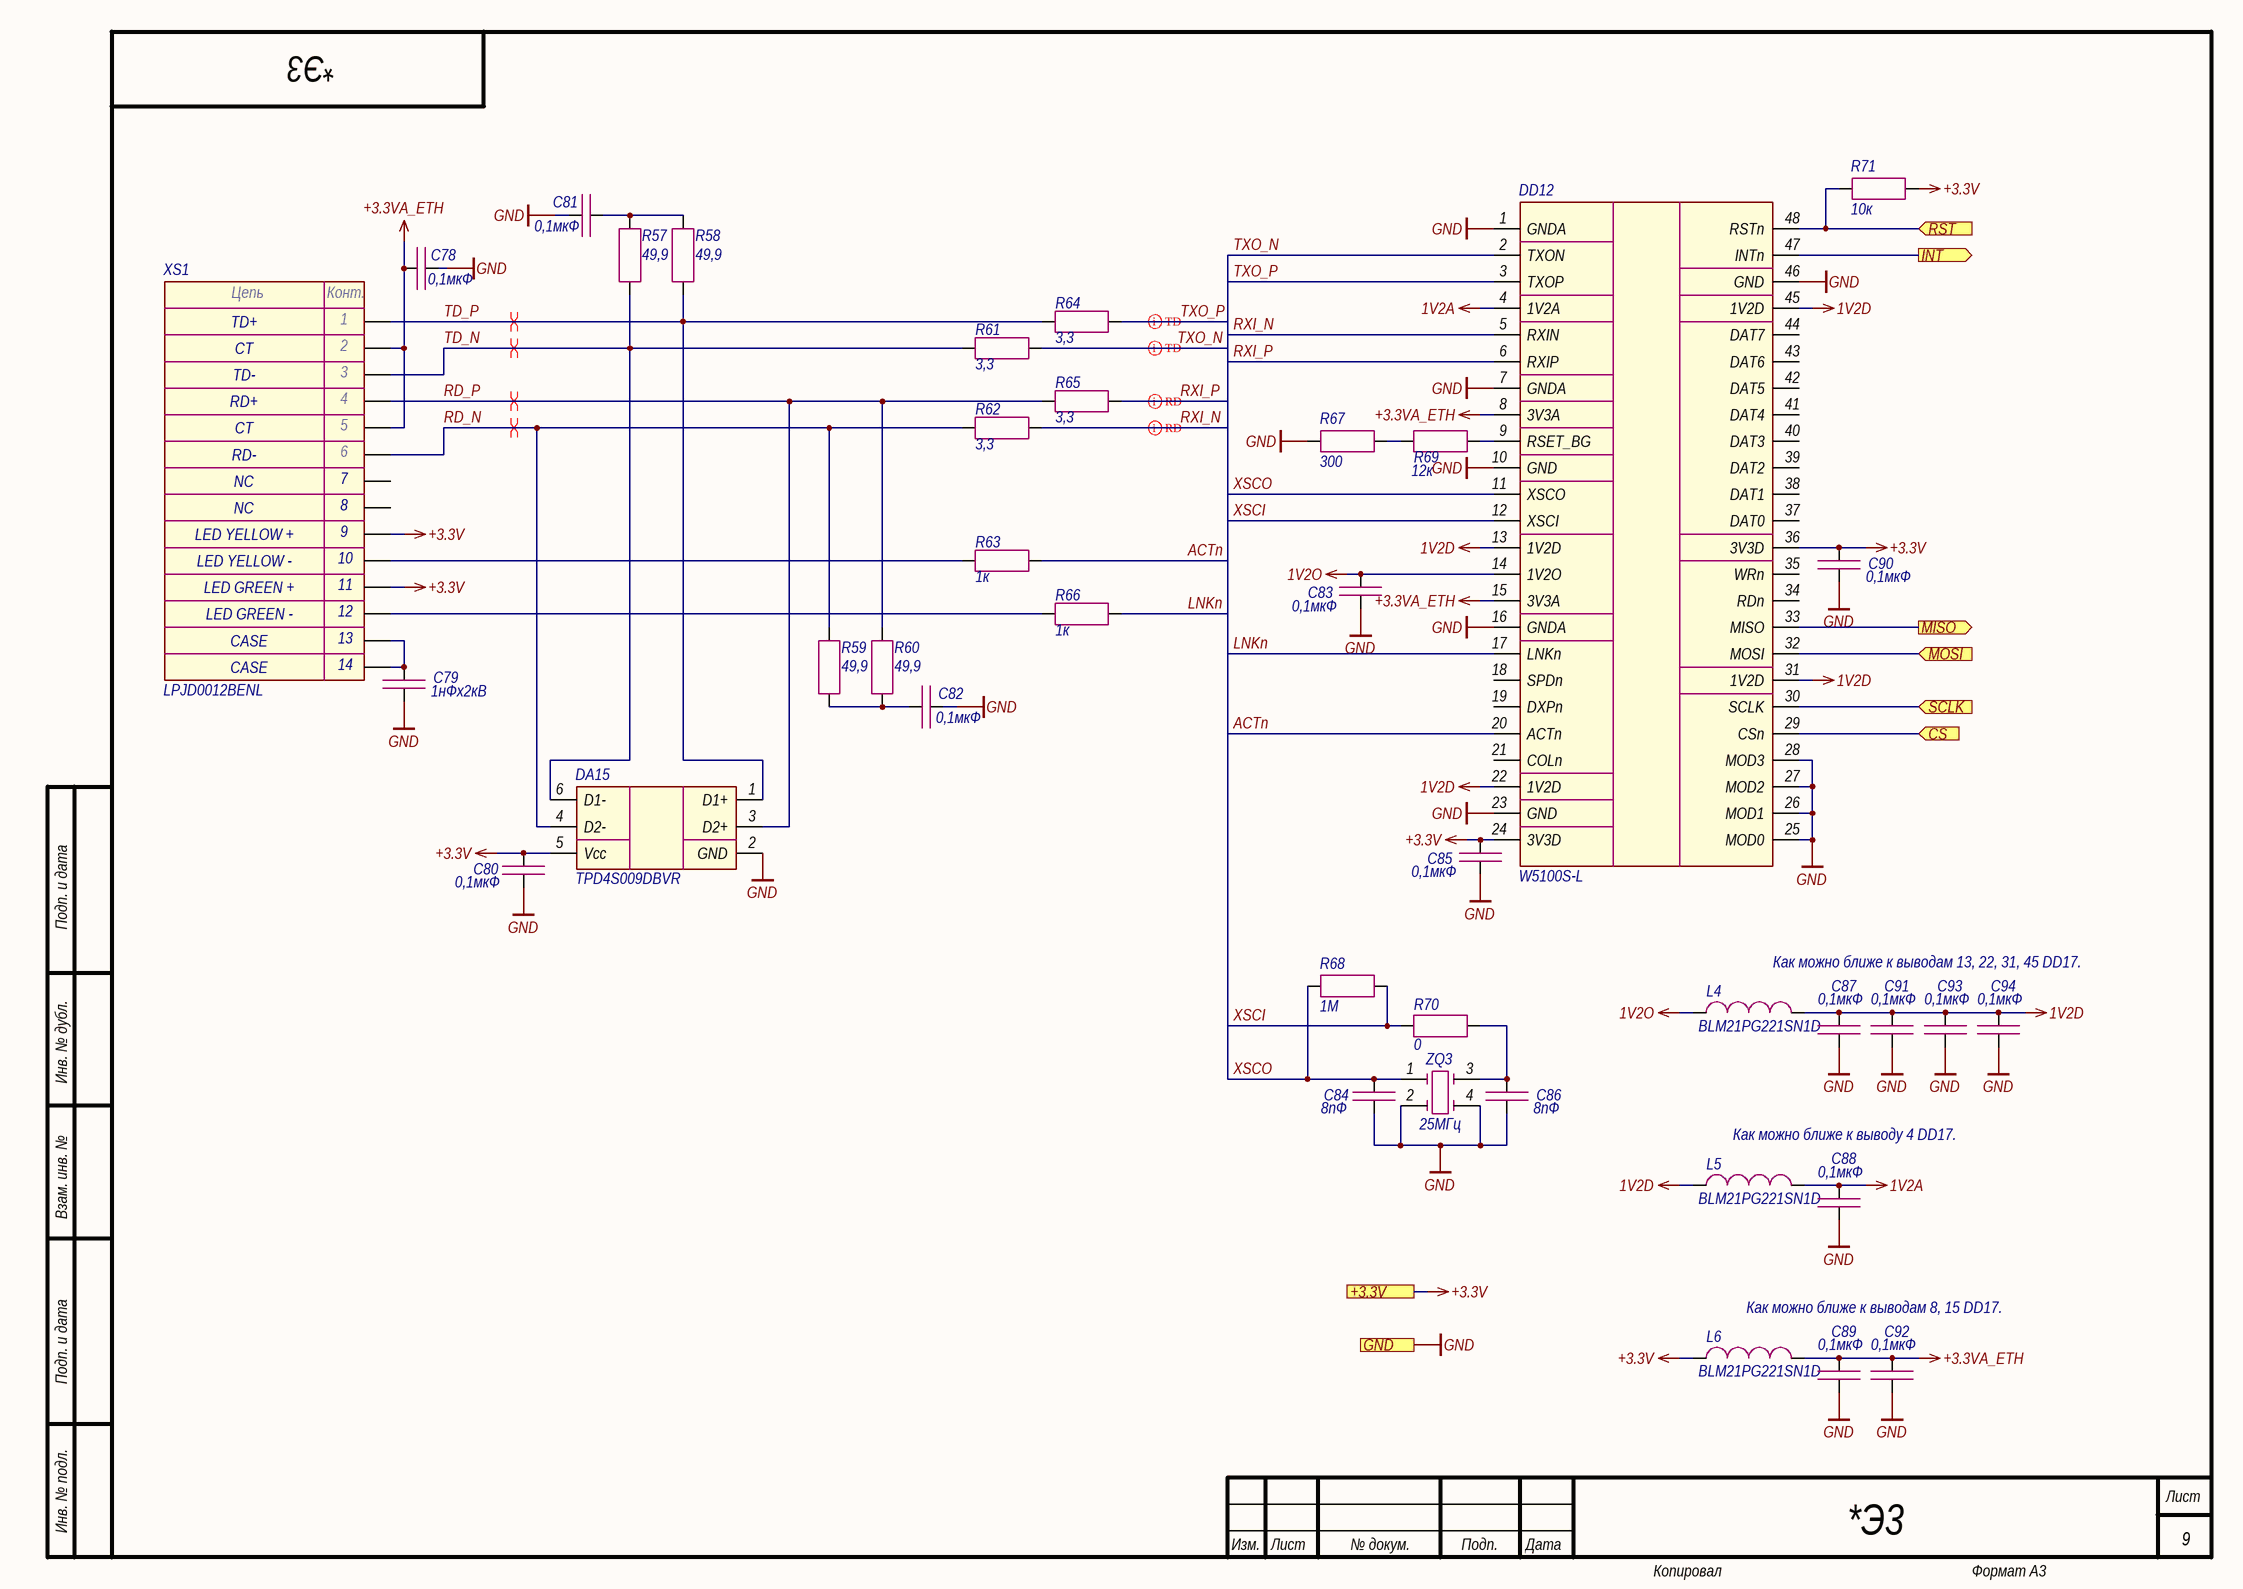
[diagram p3: Ethernet.SchDoc]

### Parts
C78  0,1мкФ  [CAP_0603]
C79  1нФх2кВ  [CAP_1206]
C80  0,1мкФ  [CAP_0603]
C81  0,1мкФ  [CAP_0603]
C82  0,1мкФ  [CAP_0603]
C83  0,1мкФ  [CAP_0603]
C84  8пФ  [CAP_0603]
C85  0,1мкФ  [CAP_0603]
C86  8пФ  [CAP_0603]
C87  0,1мкФ  [CAP_0603]
C88  0,1мкФ  [CAP_0603]
C89  0,1мкФ  [CAP_0603]
C90  0,1мкФ  [CAP_0603]
C91  0,1мкФ  [CAP_0603]
C92  0,1мкФ  [CAP_0603]
C93  0,1мкФ  [CAP_0603]
C94  0,1мкФ  [CAP_0603]
DA15  TPD4S009DBVR  [SOT-23-6]
DD12  W5100S-L  [LQFP-48]
L4  BLM21PG221SN1D  [IND_0805]
L5  BLM21PG221SN1D  [IND_0805]
L6  BLM21PG221SN1D  [IND_0805]
R57  49,9  [RES_0603]
R58  49,9  [RES_0603]
R59  49,9  [RES_0603]
R60  49,9  [RES_0603]
R61  3,3  [RES_0603]
R62  3,3  [RES_0603]
R63  1к  [RES_0603]
R64  3,3  [RES_0603]
R65  3,3  [RES_0603]
R66  1к  [RES_0603]
R67  300  [RES_0603]
R68  1М  [RES_0603]
R69  12к  [RES_0603]
R70  0  [RES_0603]
R71  10к  [RES_0603]
XS1  LPJD0012BENL  [LPJD0012BENL]
ZQ3  25МГц  [7M]

### Ports
+3.3V (see Main[3B], Fiber_interlock[2C], Flow_sensor[2C], Hardwiring[3D], LD_driver[1D], Power_supply[1D]), CS (in, see Main[2B]), GND (see Main[3B], Fiber_interlock[2C], Flow_sensor[2C], Guide_laser[1C], Hardwiring[3D], Indication[1C], LD_driver[1D], Power_supply[1D]), INT (out, see Main[3B]), MISO (out, see Main[2B]), MOSI (in, see Main[2B]), RST (in, see Main[3B]), SCLK (in, see Main[2B])

### Nets
1V2A: C88.1 DD12.4(1V2A) L5.2
1V2D: C87.1 C91.1 C93.1 C94.1 DD12.13(1V2D) DD12.22(1V2D) DD12.31(1V2D) DD12.45(1V2D) L4.2 L5.1
1V2O: C83.1 DD12.14(1V2O) L4.1
+3.3V: C80.1 C85.1 C90.1 DA15.5(Vcc) DD12.24(3V3D) DD12.36(3V3D) L6.1 R71.2 XS1.9 XS1.11 ; port +3.3V
+3.3VA_ETH: C78.1 C89.1 C92.1 DD12.8(3V3A) DD12.15(3V3A) L6.2 XS1.2 XS1.5
GND: C78.2 C79.2 C80.2 C81.2 C82.2 C83.2 C84.2 C85.2 C86.2 C87.2 C88.2 C89.2 C90.2 C91.2 C92.2 C93.2 C94.2 DA15.2(GND) DD12.1(GNDA) DD12.7(GNDA) DD12.10(GND) DD12.16(GNDA) DD12.23(GND) DD12.25(MOD0) DD12.26(MOD1) DD12.27(MOD2) DD12.28(MOD3) DD12.46(GND) R67.1 ZQ3.2 ZQ3.4 ; port GND
ACTn: DD12.20(ACTn) R63.2
ETH_CS: DD12.29(CSn) ; port CS
ETH_INT: DD12.47(INTn) ; port INT
ETH_MISO: DD12.33(MISO) ; port MISO
ETH_MOSI: DD12.32(MOSI) ; port MOSI
ETH_RST: DD12.48(RSTn) R71.1 ; port RST
ETH_SCLK: DD12.30(SCLK) ; port SCLK
LNKn: DD12.17(LNKn) R66.2
RD_N: DA15.4(D2-) R59.1 R62.2 XS1.6
RD_P: DA15.3(D2+) R60.1 R65.2 XS1.4
RXI_N: DD12.5(RXIN) R62.1
RXI_P: DD12.6(RXIP) R65.1
TD_N: DA15.6(D1-) R57.1 R61.2 XS1.3
TD_P: DA15.1(D1+) R58.1 R64.2 XS1.1
TXO_N: DD12.2(TXON) R61.1
TXO_P: DD12.3(TXOP) R64.1
XSCI: DD12.12(XSCI) R68.2 R70.1
XSCO: C84.1 DD12.11(XSCO) R68.1 ZQ3.1
NetC79_1: C79.1 XS1.13 XS1.14
NetC81_1: C81.1 R57.2 R58.2
NetC82_1: C82.1 R59.2 R60.2
NetC86_1: C86.1 R70.2 ZQ3.3
NetDD12_9: DD12.9(RSET_BG) R69.2
NetR63_1: R63.1 XS1.10
NetR66_1: R66.1 XS1.12
NetR67_2: R67.2 R69.1

Not connected (* = marked no-connect by the designer): DD12 18(SPDn) 19(DXPn) 21(COLn) 34(RDn) 35(WRn) 37(DAT0) 38(DAT1) 39(DAT2) 40(DAT3) 41(DAT4) 42(DAT5) 43(DAT6) 44(DAT7); XS1 7 8

### Layout directives
differential pair; differential pair class TD: TXO_N, TXO_P
differential pair; differential pair class RD: RXI_N, RXI_P
differential pair: RD_N, RD_P, TD_N, TD_P

### Notes on the sheet
- Как можно ближе к выводам 13, 22, 31, 45 DD17.
- Как можно ближе к выводу 4 DD17.
- Как можно ближе к выводам 8, 15 DD17.
- Подп. и дата
- Инв. № дубл.
- Взам. инв. №
- Инв. № подл.
- Изм.
- Лист
- № докум.
- Подп.
- Дата
- Копировал
- Формат А3
- (in symbol LPJD0012BENL) Цепь; Конт.; TD+; CT; TD-; RD+; RD-; NC; LED YELLOW +; LED YELLOW -; LED GREEN +; LED GREEN -; CASE

### Library data of the parts
C78 C80-C83 C85 C87-C94 = Capacitor: as C3 on sheet Main; Value: 0,1мкФ; Document: *
C79 = Capacitor: Manufacturer: Yageo; Model: CC1206KKX7RDBB102; Value: 1нФх2кВ; Document: *
C84 C86 = Capacitor: as C24 on sheet Main; Value: 8пФ; Document: *
DA15 = TPD4S009: Manufacturer: Texas Instruments; Model: TPD4S009DBVR; Document: *
DD12 = W5100S: Manufacturer: Wiznet; Model: W5100S-L; Document: *
L4-L6 = Inductor: Manufacturer: Murata; Value: *; Model: BLM21PG221SN1D; Document: *
R57-R60 = Resistor: Manufacturer: Yageo; Model: RC0603FR-0749R9L; Value: 49,9; Document: *
R61 R62 R64 R65 = Resistor: Manufacturer: Yageo; Model: RC0603FR-073R3L; Value: 3,3; Document: *
R63 R66 = Resistor: Manufacturer: Yageo; Model: RC0603FR-071KL; Value: 1к; Document: *
R67 = Resistor: Manufacturer: Yageo; Model: RC0603FR-07300RL; Value: 300; Document: *
R68 = Resistor: Manufacturer: Yageo; Model: RC0603FR-071ML; Value: 1М; Document: *
R69 = Resistor: Manufacturer: Yageo; Model: RC0603FR-0712KL; Value: 12к; Document: *
R70 = Resistor: as R105 on sheet Hardwiring; Value: 0; Document: *
R71 = Resistor: as R6 on sheet Main; Value: 10к; Document: *
XS1 = LPJD0012BENL: Manufacturer: LINK-PP; Model: LPJD0012BENL; Document: *
ZQ3 = Quartz_Resonator_4-pin: Manufacturer: TXC; Model: 7M-25.000MAAJ-T; Value: 25МГц; Document: *

## Sheet Photodiode.SchDoc
size 420 x 297 mm; Address1: Address1; Address2: Address2; Address3: Address3; Address4: Address4; DocumentNumber: *Э3; SheetNumber: 2; SheetTotal: 11; DocumentType: Схема электрическая *
Used 3 times, as channels A1, A2, A3. Parts and nets are listed once, with the designators drawn on the sheet.
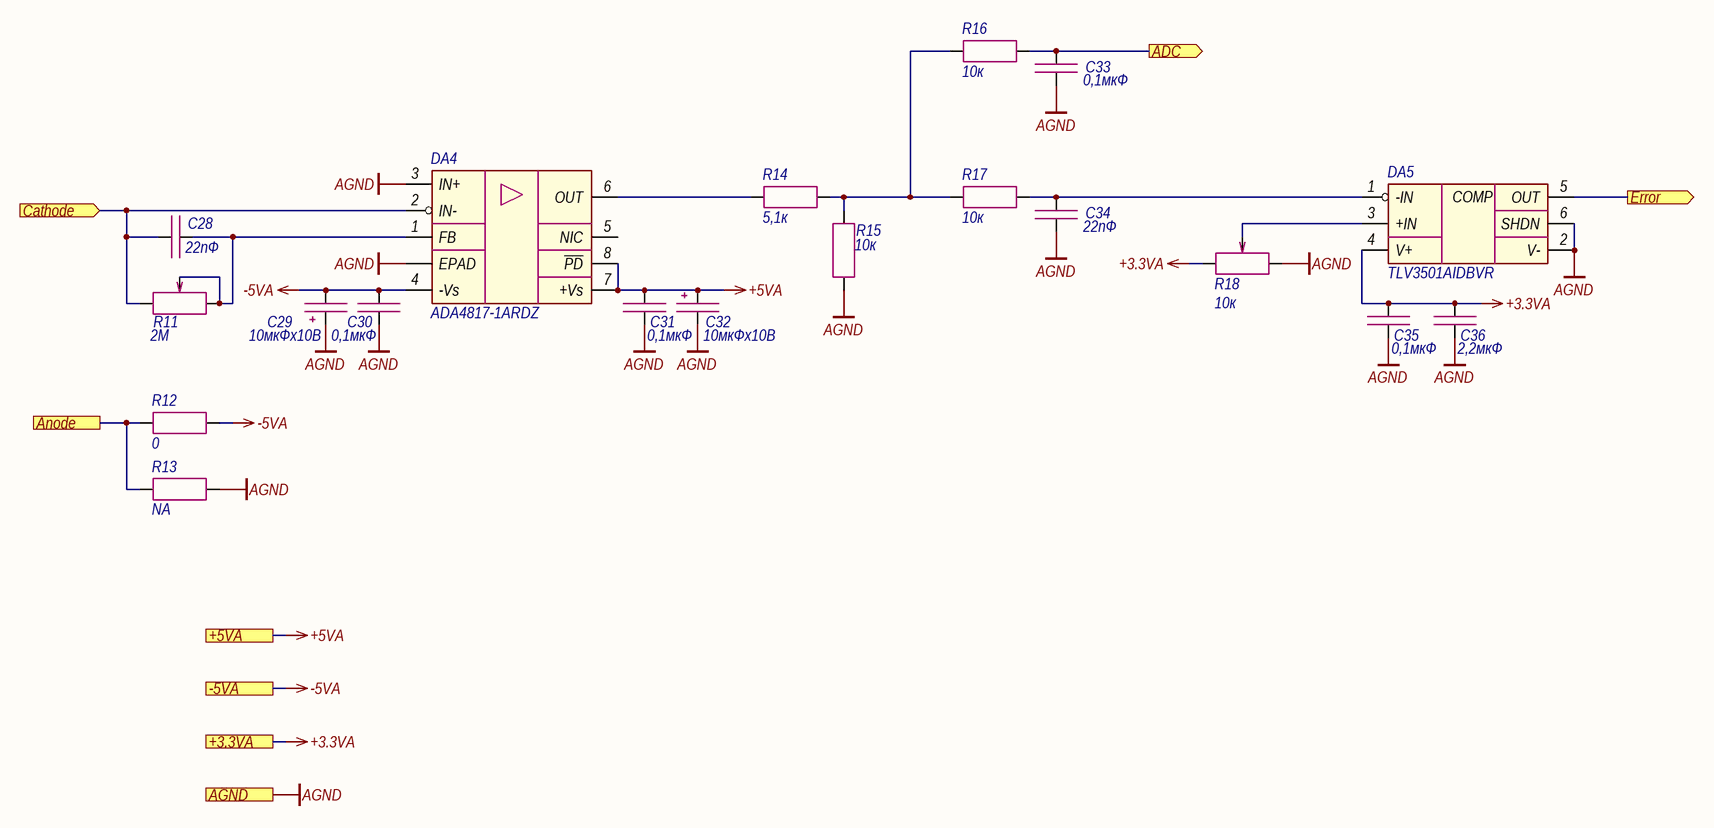
[diagram p4: Photodiode.SchDoc]

### Parts
C28  22пФ  [CAP_0603]
C29  10мкФх10B  [CAP_A]
C30  0,1мкФ  [CAP_0603]
C31  0,1мкФ  [CAP_0603]
C32  10мкФх10B  [CAP_A]
C33  0,1мкФ  [CAP_0603]
C34  22пФ  [CAP_0603]
C35  0,1мкФ  [CAP_0603]
C36  2,2мкФ  [CAP_0603]
DA4  ADA4817-1ARDZ  [SOIC-8 EPAD]
DA5  TLV3501AIDBVR  [SOT-23-6]
R11  2М  [3224W]
R12  0  [RES_0603]
R13  NA  [RES_0603]
R14  5,1к  [RES_0603]
R15  10к  [RES_0603]
R16  10к  [RES_0603]
R17  10к  [RES_0603]
R18  10к  [3224W]

### Ports
+3.3VA (see Main[2A], Thermistor[2C]), +5VA (see Main[1A], Hardwiring[4D], LD_driver[1D]), -5VA (see Main[1A]), ADC (out, see Main[2A]), AGND (see Main[2A], Hardwiring[4D], LD_driver[1D], Thermistor[2C]), Anode (see Main[1A]), Cathode (in, see Main[1A]), Error (out, see Main[2A])

### Nets
+3.3VA: C35.1 C36.1 DA5.4(V+) R18.3 ; port +3.3VA
+5VA: C31.1 C32.1 DA4.7(+Vs) DA4.8(~{PD}) ; port +5VA
-5VA: C29.2 C30.1 DA4.4(-Vs) R12.1 ; port -5VA
AGND: C29.1 C30.2 C31.2 C32.2 C33.2 C34.2 C35.2 C36.2 DA4.3(IN+) DA4.EPAD DA5.2(V-) DA5.6(SHDN) R13.2 R15.2 R18.1 ; port AGND
ADC: C33.1 R16.2 ; port ADC
Anode: R12.2 R13.1 ; port Anode
Cathode: C28.2 DA4.2(IN-) R11.1 ; port Cathode
Error: DA5.5(OUT) ; port Error
NetC28_1: C28.1 DA4.1(FB) R11.2 R11.3
NetC34_1: C34.1 DA5.1(-IN) R17.2
NetDA4_6: DA4.6(OUT) R14.1
NetDA5_3: DA5.3(+IN) R18.2
NetR14_2: R14.2 R15.1 R16.1 R17.1

Not connected (* = marked no-connect by the designer): DA4 5(NIC)

### Channels
A1: designators end in A1; ports +3.3VA=+3.3VA +5VA=+5VA -5VA=-5VA ADC=PD3_ADC AGND=AGND Anode=PD3_A Cathode=PD3_C Error=PD3_ERR
A2: designators end in A2; ports +3.3VA=+3.3VA +5VA=+5VA -5VA=-5VA ADC=PD2_ADC AGND=AGND Anode=PD2_A Cathode=PD2_C Error=PD2_ERR
A3: designators end in A3; ports +3.3VA=+3.3VA +5VA=+5VA -5VA=-5VA ADC=PD1_ADC AGND=AGND Anode=PD1_A Cathode=PD1_C Error=PD1_ERR

### Notes on the sheet
- Подп. и дата
- Инв. № дубл.
- Взам. инв. №
- Инв. № подл.
- Изм.
- Лист
- № докум.
- Подп.
- Дата
- Копировал
- Формат А3
- (in symbol TLV3501) COMP

### Library data of the parts
C28 C34 = Capacitor: Manufacturer: Murata; Model: GRM1885C1H220JA01D; Value: 22пФ; Document: *
C29 C32 = Capacitor_Polar: Model: TECAP, 10 мкФ, 10 В, тип A, 10%; Value: 10мкФх10B; Document: *; Manufacturer: *
C30 C31 C33 C35 = Capacitor: as C3 on sheet Main; Value: 0,1мкФ; Document: *
C36 = Capacitor: as C9 on sheet Main; Value: 2,2мкФ; Document: *
DA4 = ADA4817-1ARDZ: Manufacturer: Analog Devices; Model: ADA4817-1ARDZ; Document: *
DA5 = TLV3501: Manufacturer: Texas Instruments; Model: TLV3501AIDBVR; Document: *
R11 = Resistor_Variable: Manufacturer: Bourns; Model: 3224W-1-205E; Value: 2М; Document: *
R12 = Resistor: as R105 on sheet Hardwiring; Value: 0; Document: *
R13 = Resistor: Value: NA; Model: *; Document: *; Manufacturer: *
R14 = Resistor: Manufacturer: Yageo; Model: RC0603FR-075K1L; Value: 5,1к; Document: *
R15-R17 = Resistor: as R6 on sheet Main; Value: 10к; Document: *
R18 = Resistor_Variable: Manufacturer: Bourns; Model: 3224W-1-103; Value: 10к; Document: *

## Sheet Thermistor.SchDoc
size 209 x 297 mm; Address1: Address1; Address2: Address2; Address3: Address3; Address4: Address4; DocumentNumber: *Э3; SheetNumber: 3; SheetTotal: 11; DocumentType: Схема электрическая *
Used 2 times, as channels A4, A5. Parts and nets are listed once, with the designators drawn on the sheet.
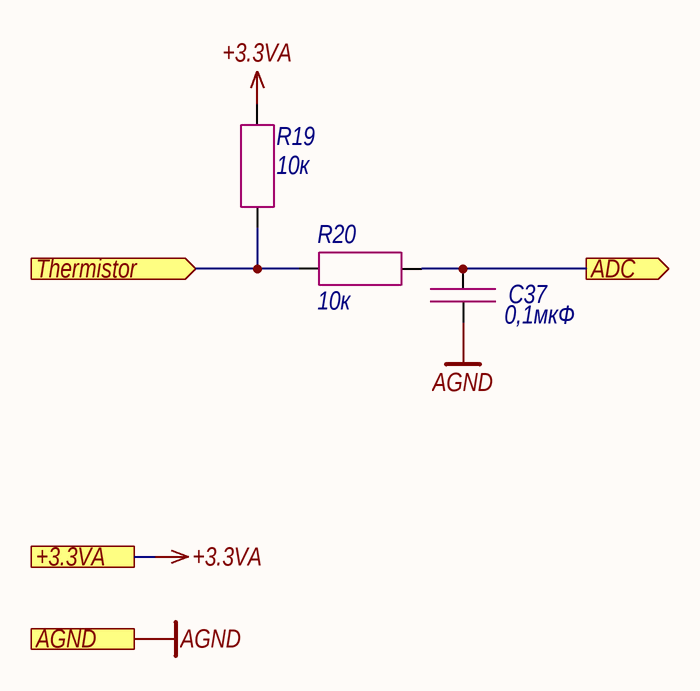
[diagram p5: Thermistor.SchDoc]

### Parts
C37  0,1мкФ  [CAP_0603]
R19  10к  [RES_0603]
R20  10к  [RES_0603]

### Ports
+3.3VA (see Main[1B], Photodiode[1C]), ADC (out, see Main[2B]), AGND (see Main[1B], Hardwiring[4D], LD_driver[1D], Photodiode[1D]), Thermistor (in, see Main[1B])

### Nets
+3.3VA: R19.1 ; port +3.3VA
AGND: C37.2 ; port AGND
ADC: C37.1 R20.2 ; port ADC
Thermistor: R19.2 R20.1 ; port Thermistor

### Channels
A4: designators end in A4; ports +3.3VA=+3.3VA ADC=T1_ADC AGND=AGND Thermistor=T1
A5: designators end in A5; ports +3.3VA=+3.3VA ADC=T2_ADC AGND=AGND Thermistor=T2

### Notes on the sheet
- Подп. и дата
- Инв. № дубл.
- Взам. инв. №
- Инв. № подл.
- Изм.
- Лист
- № докум.
- Подп.
- Дата
- Копировал
- Формат А4

### Library data of the parts
C37 = Capacitor: as C3 on sheet Main; Value: 0,1мкФ; Document: *
R19 R20 = Resistor: as R6 on sheet Main; Value: 10к; Document: *

## Sheet Power_supply.SchDoc
size 420 x 297 mm; Address1: Address1; Address2: Address2; Address3: Address3; Address4: Address4; DocumentNumber: *Э3; SheetNumber: 4; SheetTotal: 11; DocumentType: Схема электрическая *
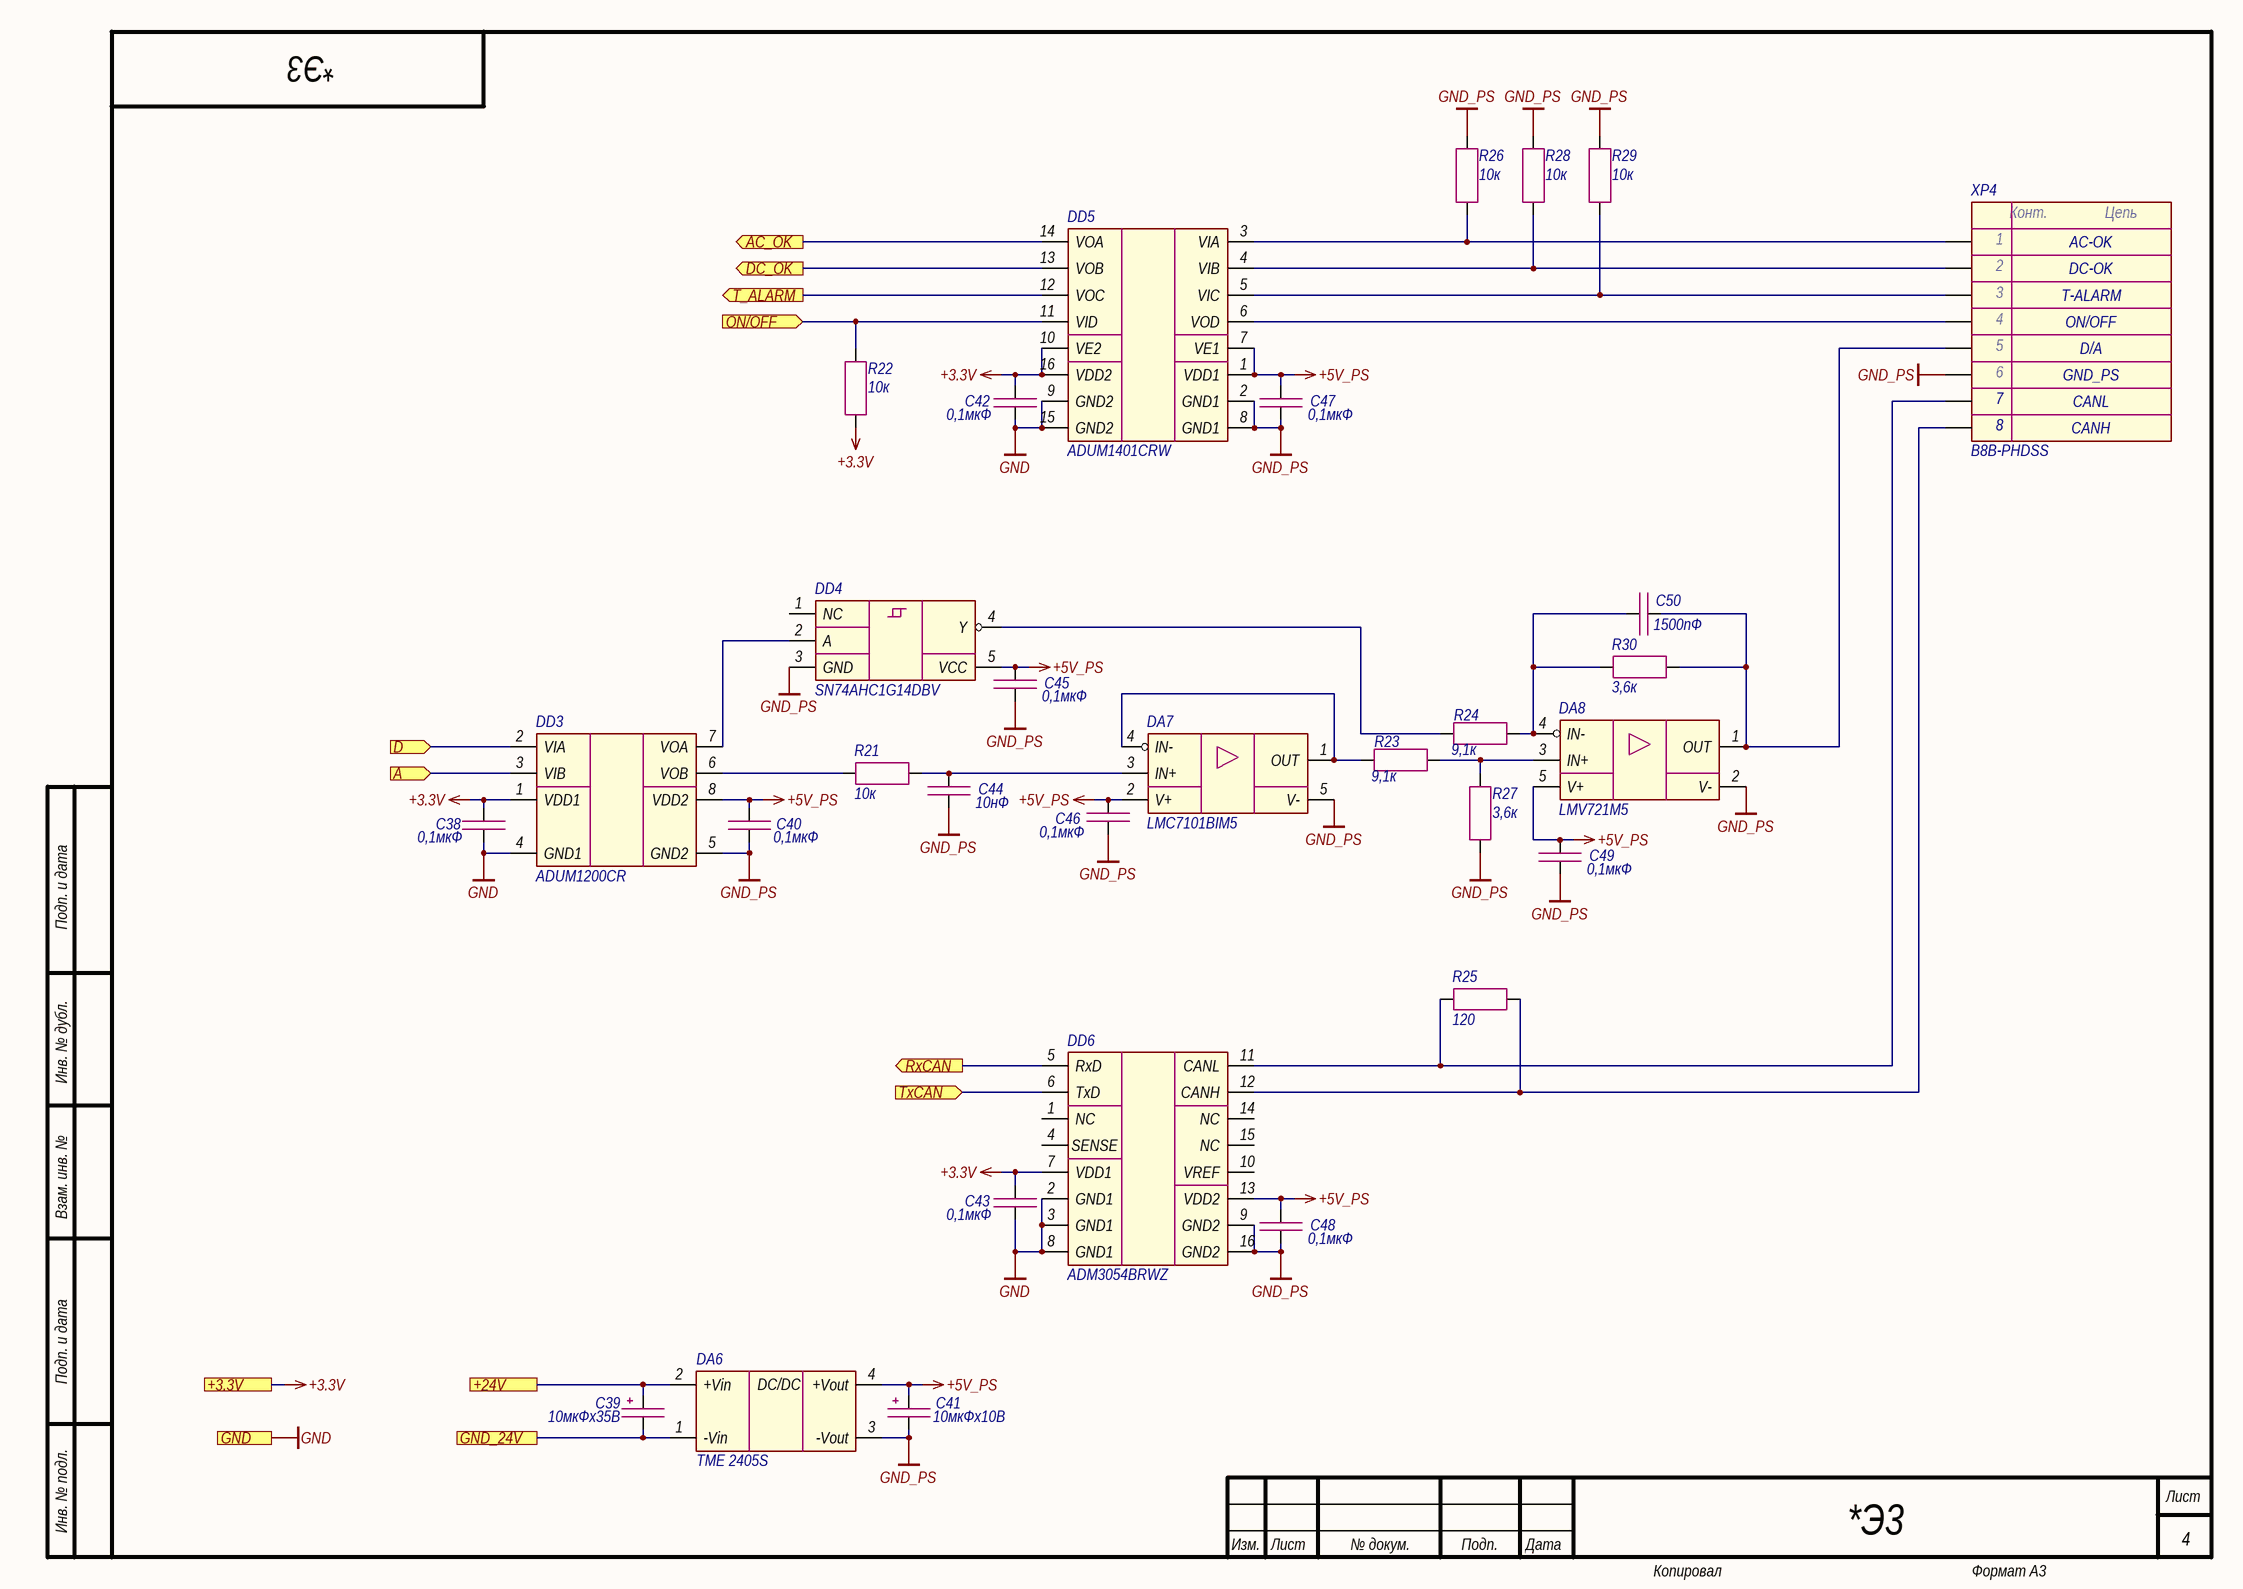
[diagram p6: Power_supply.SchDoc]

### Parts
C38  0,1мкФ  [CAP_0603]
C39  10мкФх35B  [CAP_C]
C40  0,1мкФ  [CAP_0603]
C41  10мкФх10B  [CAP_A]
C42  0,1мкФ  [CAP_0603]
C43  0,1мкФ  [CAP_0603]
C44  10нФ  [CAP_0603]
C45  0,1мкФ  [CAP_0603]
C46  0,1мкФ  [CAP_0603]
C47  0,1мкФ  [CAP_0603]
C48  0,1мкФ  [CAP_0603]
C49  0,1мкФ  [CAP_0603]
C50  1500пФ  [CAP_0603]
DA6  TME 2405S  [TME (SIP-4)]
DA7  LMC7101BIM5  [SOT-23-5]
DA8  LMV721M5  [SOT-23-5]
DD3  ADUM1200CR  [SOIC-8]
DD4  SN74AHC1G14DBV  [SOT-23-5]
DD5  ADUM1401CRW  [SOIC-16W]
DD6  ADM3054BRWZ  [SOIC-16W]
R21  10к  [RES_0603]
R22  10к  [RES_0603]
R23  9,1к  [RES_0603]
R24  9,1к  [RES_0603]
R25  120  [RES_0603]
R26  10к  [RES_0603]
R27  3,6к  [RES_0603]
R28  10к  [RES_0603]
R29  10к  [RES_0603]
R30  3,6к  [RES_0603]
XP4  B8B-PHDSS  [B8B-PHDSS]

### Ports
+3.3V (see Main[2B], Ethernet[3D], Fiber_interlock[2C], Flow_sensor[2C], Hardwiring[3D], LD_driver[1D]), +24V (see Main[1B], Flow_sensor[2C], Hardwiring[3C], Indication[1C], LD_driver[1D]), A (in, see Main[1B]), AC_OK (out, see Main[2B]), D (in, see Main[1B]), DC_OK (out, see Main[2B]), GND (see Main[2C], Ethernet[3D], Fiber_interlock[2C], Flow_sensor[2C], Guide_laser[1C], Hardwiring[3D], Indication[1C], LD_driver[1D]), GND_24V (see Main[1B], Flow_sensor[2C], Hardwiring[3C], Indication[1C], LD_driver[1D]), ON/OFF (in, see Main[1B]), RxCAN (out, see Main[2B]), T_ALARM (out, see Main[2B]), TxCAN (in, see Main[2B])

### Nets
+3.3V: C38.1 C42.1 C43.1 DD3.1(VDD1) DD5.10(VE2) DD5.16(VDD2) DD6.7(VDD1) R22.1 ; port +3.3V
+5V_PS: C40.1 C41.1 C45.1 C46.1 C47.1 C48.1 C49.1 DA6.4(+Vout) DA7.2(V+) DA8.5(V+) DD3.8(VDD2) DD4.5(VCC) DD5.1(VDD1) DD5.7(VE1) DD6.13(VDD2)
+24V: C39.1 DA6.2(+Vin) ; port +24V
GND: C38.2 C42.2 C43.2 DD3.4(GND1) DD5.9(GND2) DD5.15(GND2) DD6.2(GND1) DD6.3(GND1) DD6.8(GND1) ; port GND
GND_24V: C39.2 DA6.1(-Vin) ; port GND_24V
GND_PS: C40.2 C41.2 C44.2 C45.2 C46.2 C47.2 C48.2 C49.2 DA6.3(-Vout) DA7.5(V-) DA8.2(V-) DD3.5(GND2) DD4.3(GND) DD5.2(GND1) DD5.8(GND1) DD6.9(GND2) DD6.16(GND2) R26.1 R27.2 R28.1 R29.1 XP4.6
PS_A: DD3.3(VIB) ; port A
PS_D: DD3.2(VIA) ; port D
PS_ERR1: DD5.14(VOA) ; port AC_OK
PS_ERR2: DD5.13(VOB) ; port DC_OK
PS_ERR3: DD5.12(VOC) ; port T_ALARM
PS_ON: DD5.11(VID) R22.2 ; port ON/OFF
RxCAN: DD6.5(RxD) ; port RxCAN
TxCAN: DD6.6(TxD) ; port TxCAN
NetC44_1: C44.1 DA7.3(IN+) R21.2
NetC50_1: C50.1 DA8.4(IN-) R24.1 R30.2
NetC50_2: C50.2 DA8.1(OUT) R30.1 XP4.5
NetDA7_1: DA7.1(OUT) DA7.4(IN-) R23.2
NetDA8_3: DA8.3(IN+) R23.1 R27.1
NetDD3_6: DD3.6(VOB) R21.1
NetDD3_7: DD3.7(VOA) DD4.2(A)
NetDD4_4: DD4.4(Y) R24.2
NetDD5_3: DD5.3(VIA) R26.2 XP4.1
NetDD5_4: DD5.4(VIB) R28.2 XP4.2
NetDD5_5: DD5.5(VIC) R29.2 XP4.3
NetDD5_6: DD5.6(VOD) XP4.4
NetDD6_11: DD6.11(CANL) R25.1 XP4.7
NetDD6_12: DD6.12(CANH) R25.2 XP4.8

Not connected (* = marked no-connect by the designer): DD4 1(NC); DD6 1(NC) 4(SENSE) 10(VREF) 14(NC) 15(NC)

### Notes on the sheet
- AC-OK
- DC-OK
- T-ALARM
- ON/OFF
- CANL
- GND_PS
- D/A
- CANH
- Подп. и дата
- Инв. № дубл.
- Взам. инв. №
- Инв. № подл.
- Изм.
- Лист
- № докум.
- Подп.
- Дата
- Копировал
- Формат А3
- (in symbol Connector-8) Конт.; Цепь
- (in symbol TME) DC/DC

### Library data of the parts
C38 C40 C42 C43 C45-C49 = Capacitor: as C3 on sheet Main; Value: 0,1мкФ; Document: *
C39 = Capacitor_Polar: Model: TECAP, 10 мкФ, 35 В, тип C, 10%; Value: 10мкФх35B; Document: *; Manufacturer: *
C41 = Capacitor_Polar: Model: TECAP, 10 мкФ, 10 В, тип A, 10%; Value: 10мкФх10B; Document: *; Manufacturer: *
C44 = Capacitor: Manufacturer: Murata; Model: GRM188R71H103JA01D; Value: 10нФ; Document: *
C50 = Capacitor: Manufacturer: Murata; Model: GRM188R71H152KA01D; Value: 1500пФ; Document: *
DA6 = TME: Manufacturer: Traco Power; Model: TME 2405S; Document: *
DA7 = LMC7101: Manufacturer: Texas Instruments; Model: LMC7101BIM5; Document: *
DA8 = LMV721M5: Manufacturer: Texas Instruments; Model: LMV721M5; Document: *
DD3 = ADUM1200: Manufacturer: Analog Devices; Model: ADUM1200CR; Document: *
DD4 = SN74AHC1G14: Manufacturer: Texas Instruments; Model: SN74AHC1G14DBV; Document: *
DD5 = ADUM1401: Manufacturer: Analog Devices; Model: ADUM1401CRW; Document: *
DD6 = ADM3054BRWZ: Manufacturer: Analog Devices; Model: ADM3054BRWZ; Document: *
R21 R22 R26 R28 R29 = Resistor: as R6 on sheet Main; Value: 10к; Document: *
R23 R24 = Resistor: Manufacturer: Yageo; Model: RC0603FR-079K1L; Value: 9,1к; Document: *
R25 = Resistor: Manufacturer: Yageo; Model: RC0603FR-07120RL; Value: 120; Document: *
R27 R30 = Resistor: Manufacturer: Yageo; Model: RC0603FR-073K6L; Value: 3,6к; Document: *
XP4 = Connector-8: Manufacturer: JST; Model: B8B-PHDSS; Document: *

## Sheet LD_driver.SchDoc
size 420 x 297 mm; Address1: Address1; Address2: Address2; Address3: Address3; Address4: Address4; DocumentNumber: *Э3; SheetNumber: 5; SheetTotal: 11; DocumentType: Схема электрическая *
Used 2 times, as channels A7, A8. Parts and nets are listed once, with the designators drawn on the sheet.
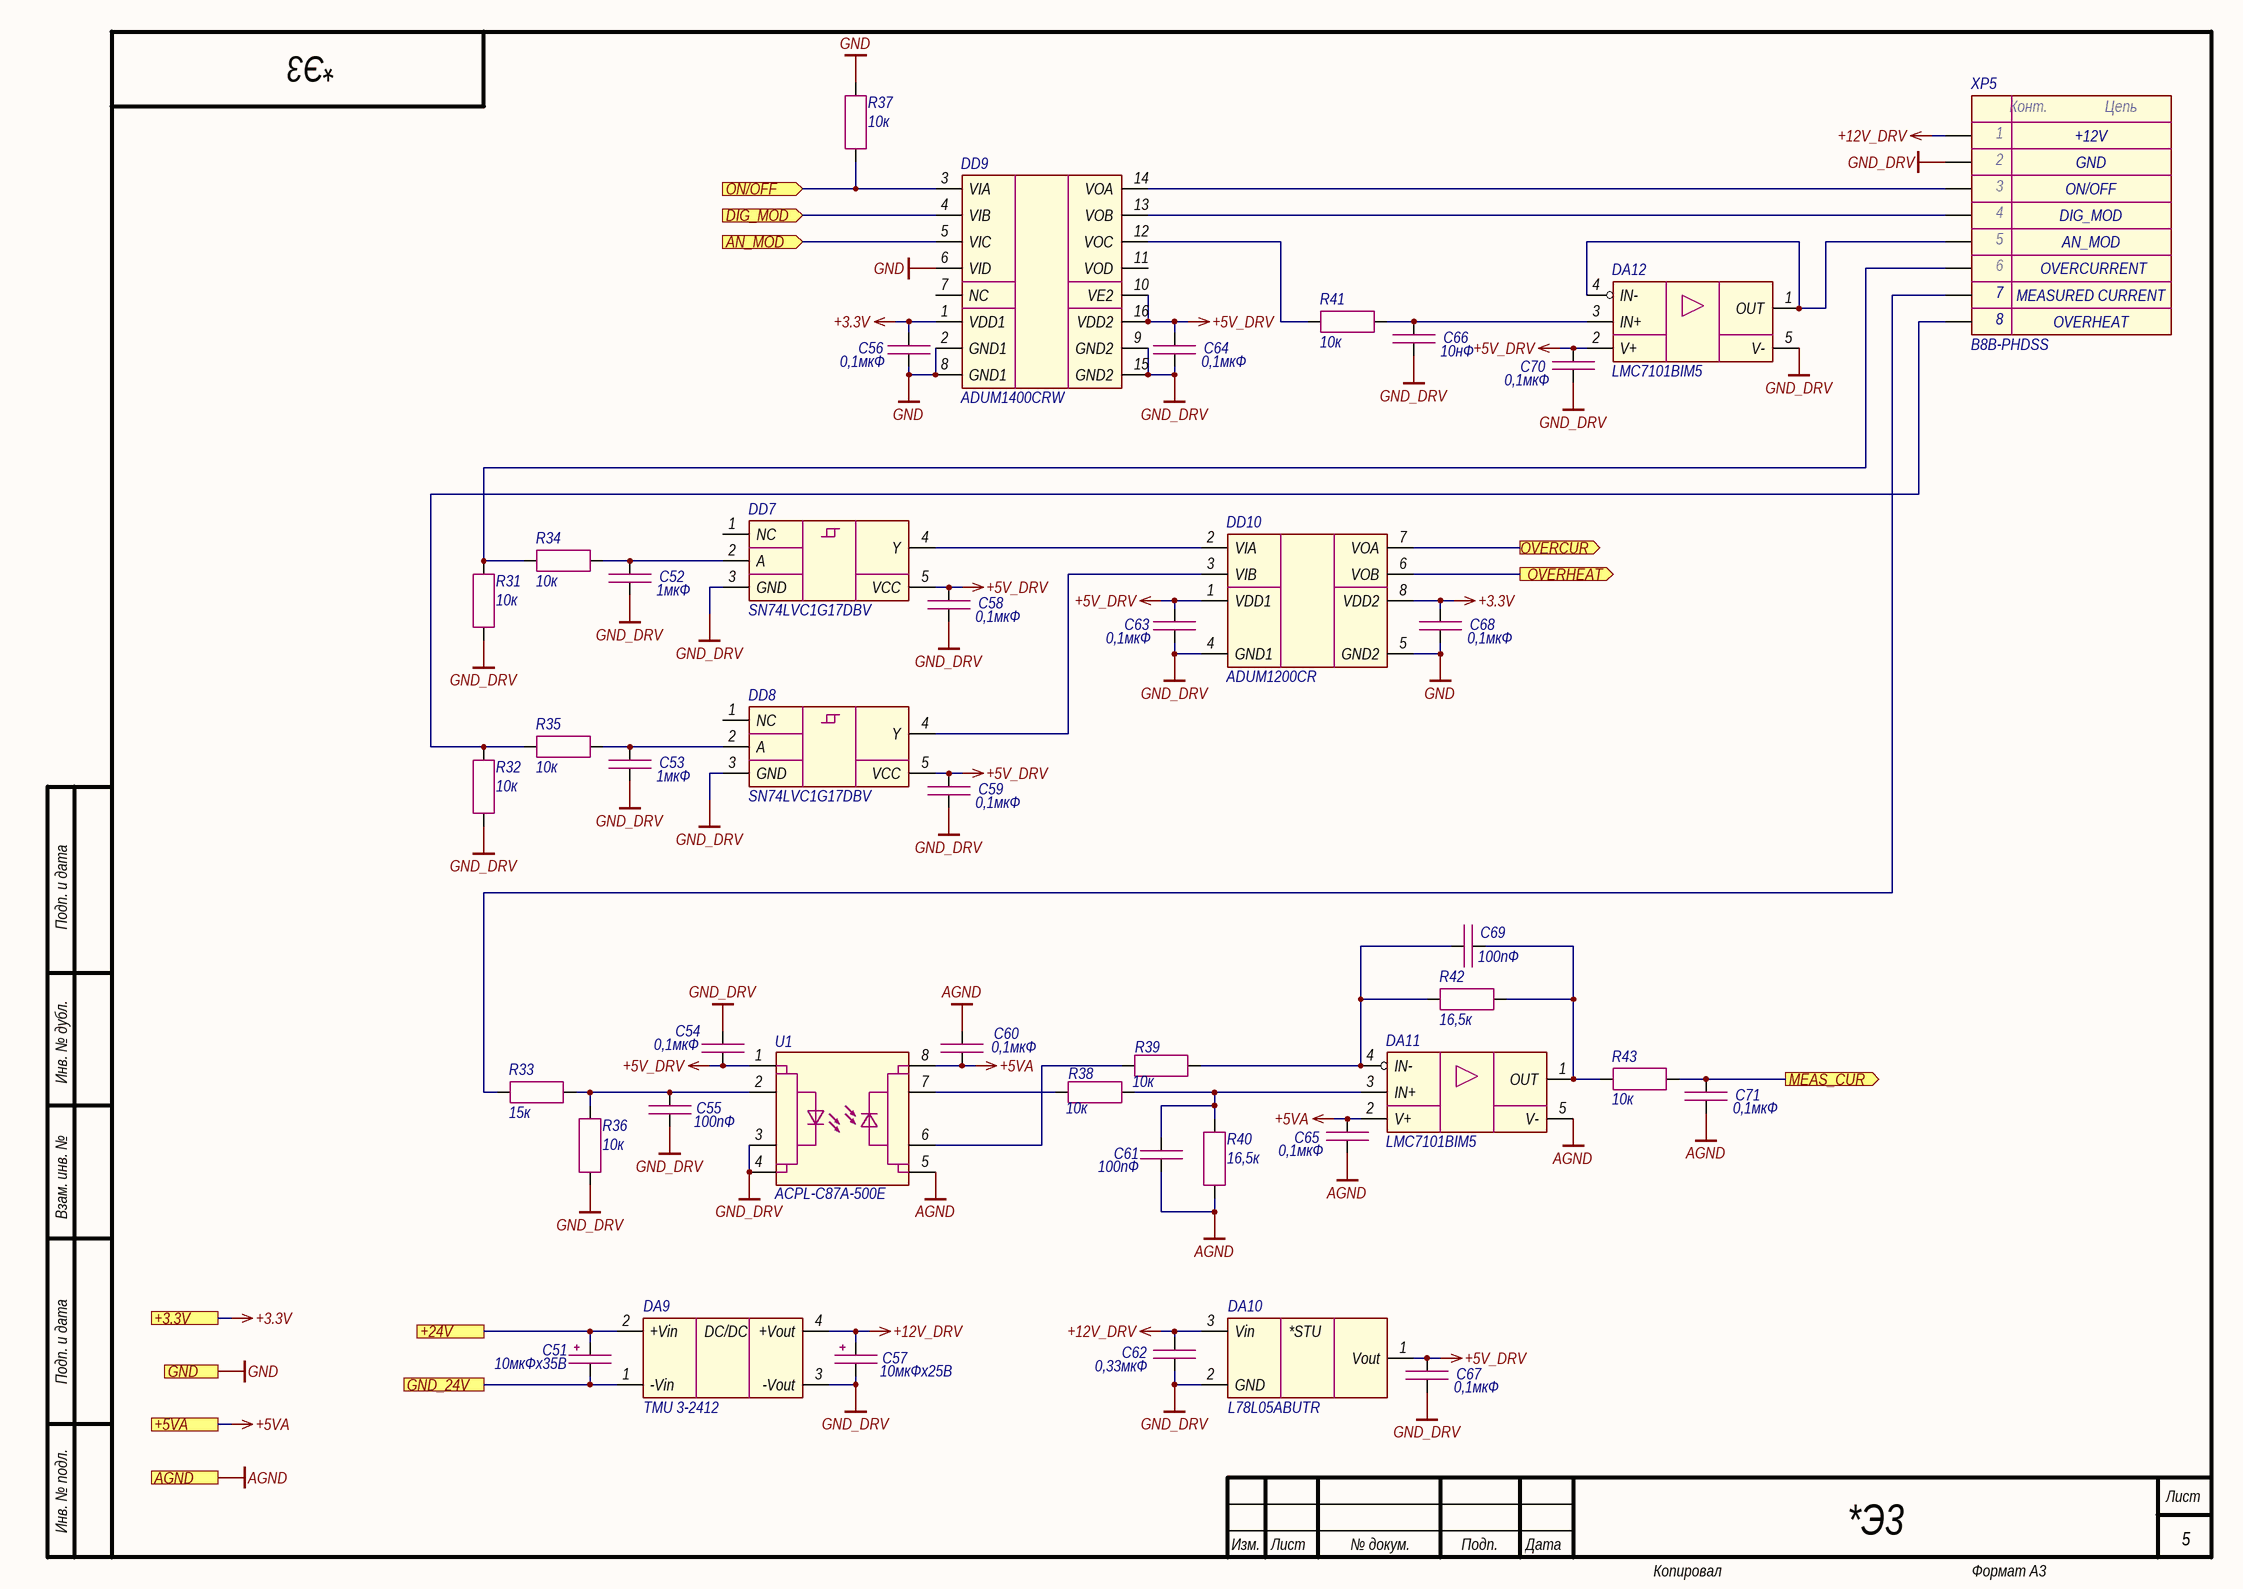
[diagram p7: LD_driver.SchDoc]

### Parts
C51  10мкФх35B  [CAP_C]
C52  1мкФ  [CAP_0603]
C53  1мкФ  [CAP_0603]
C54  0,1мкФ  [CAP_0603]
C55  100пФ  [CAP_0603]
C56  0,1мкФ  [CAP_0603]
C57  10мкФх25B  [CAP_B]
C58  0,1мкФ  [CAP_0603]
C59  0,1мкФ  [CAP_0603]
C60  0,1мкФ  [CAP_0603]
C61  100пФ  [CAP_0603]
C62  0,33мкФ  [CAP_0805]
C63  0,1мкФ  [CAP_0603]
C64  0,1мкФ  [CAP_0603]
C65  0,1мкФ  [CAP_0603]
C66  10нФ  [CAP_0603]
C67  0,1мкФ  [CAP_0603]
C68  0,1мкФ  [CAP_0603]
C69  100пФ  [CAP_0603]
C70  0,1мкФ  [CAP_0603]
C71  0,1мкФ  [CAP_0603]
DA9  TMU 3-2412  [TMU3 (SIP-4)]
DA10  L78L05ABUTR  [SOT-89]
DA11  LMC7101BIM5  [SOT-23-5]
DA12  LMC7101BIM5  [SOT-23-5]
DD7  SN74LVC1G17DBV  [SOT-23-5]
DD8  SN74LVC1G17DBV  [SOT-23-5]
DD9  ADUM1400CRW  [SOIC-16W]
DD10  ADUM1200CR  [SOIC-8]
R31  10к  [RES_0603]
R32  10к  [RES_0603]
R33  15к  [RES_0603]
R34  10к  [RES_0603]
R35  10к  [RES_0603]
R36  10к  [RES_0603]
R37  10к  [RES_0603]
R38  10к  [RES_0603]
R39  10к  [RES_0603]
R40  16,5к  [RES_0603]
R41  10к  [RES_0603]
R42  16,5к  [RES_0603]
R43  10к  [RES_0603]
U1  ACPL-C87A-500E  [SSO-8]
XP5  B8B-PHDSS  [B8B-PHDSS]

### Ports
+3.3V (see Main[2C], Ethernet[3D], Fiber_interlock[2C], Flow_sensor[2C], Hardwiring[3D], Power_supply[1D]), +5VA (see Main[2C], Hardwiring[4D], Photodiode[1C]), +24V (see Main[1C], Flow_sensor[2C], Hardwiring[3C], Indication[1C], Power_supply[1D]), AGND (see Main[2C], Hardwiring[4D], Photodiode[1D], Thermistor[2C]), AN_MOD (in, see Main[1C]), DIG_MOD (in, see Main[1C]), GND (see Main[2C], Ethernet[3D], Fiber_interlock[2C], Flow_sensor[2C], Guide_laser[1C], Hardwiring[3D], Indication[1C], Power_supply[1D]), GND_24V (see Main[1C], Flow_sensor[2C], Hardwiring[3C], Indication[1C], Power_supply[1D]), MEAS_CUR (out, see Main[2C]), ON/OFF (in, see Main[1C]), OVERCUR (out, see Main[2C]), OVERHEAT (out, see Main[2C])

### Nets
+3.3V: C56.1 C68.1 DD9.1(VDD1) DD10.8(VDD2) ; port +3.3V
+5V_DRV: C54.1 C58.1 C59.1 C63.1 C64.1 C67.1 C70.1 DA10.1(Vout) DA12.2(V+) DD7.5(VCC) DD8.5(VCC) DD9.10(VE2) DD9.16(VDD2) DD10.1(VDD1) U1.1(VDD1)
+5VA: C60.1 C65.1 DA11.2(V+) U1.8(VDD2) ; port +5VA
+12V_DRV: C57.1 C62.2 DA9.4(+Vout) DA10.3(Vin) XP5.1
AGND: C60.2 C61.2 C65.2 C71.2 DA11.5(V-) R40.2 U1.5(GND2) ; port AGND
GND: C56.2 C68.2 DD9.2(GND1) DD9.6(VID) DD9.8(GND1) DD10.5(GND2) R37.1 ; port GND
GND_DRV: C52.2 C53.2 C54.2 C55.1 C57.2 C58.2 C59.2 C62.1 C63.2 C64.2 C66.2 C67.2 C70.2 DA9.3(-Vout) DA10.2(GND) DA12.5(V-) DD7.3(GND) DD8.3(GND) DD9.9(GND2) DD9.15(GND2) DD10.4(GND1) R31.1 R32.1 R36.2 U1.3(SHDN) U1.4(GND1) XP5.2
+24V: C51.1 DA9.2(+Vin) ; port +24V
AN_MOD: DD9.5(VIC) ; port AN_MOD
DIG_MOD: DD9.4(VIB) ; port DIG_MOD
GND_24V: C51.2 DA9.1(-Vin) ; port GND_24V
MEAS_CUR: C71.1 R43.2 ; port MEAS_CUR
ON/OFF: DD9.3(VIA) R37.2 ; port ON/OFF
OVERCUR: DD10.7(VOA) ; port OVERCUR
OVERHEAT: DD10.6(VOB) ; port OVERHEAT
NetC52_1: C52.1 DD7.2(A) R34.2
NetC53_1: C53.1 DD8.2(A) R35.2
NetC55_2: C55.2 R33.1 R36.1 U1.2(VIN)
NetC61_1: C61.1 DA11.3(IN+) R38.2 R40.1
NetC66_1: C66.1 DA12.3(IN+) R41.2
NetC69_1: C69.1 DA11.4(IN-) R39.2 R42.2
NetC69_2: C69.2 DA11.1(OUT) R42.1 R43.1
NetDA12_1: DA12.1(OUT) DA12.4(IN-) XP5.5
NetDD7_4: DD7.4(Y) DD10.2(VIA)
NetDD8_4: DD8.4(Y) DD10.3(VIB)
NetDD9_12: DD9.12(VOC) R41.1
NetDD9_13: DD9.13(VOB) XP5.4
NetDD9_14: DD9.14(VOA) XP5.3
NetR31_2: R31.2 R34.1 XP5.6
NetR32_2: R32.2 R35.1 XP5.8
NetR33_2: R33.2 XP5.7
NetR38_1: R38.1 U1.7(VOUT+)
NetR39_1: R39.1 U1.6(VOUT-)

Not connected (* = marked no-connect by the designer): DD7 1(NC); DD8 1(NC); DD9 7(NC) 11(VOD)

### Channels
A7: designators end in A7; ports +3.3V=+3.3V +5VA=+5VA +24V=+24V AGND=AGND AN_MOD=DRV1_AN_MOD DIG_MOD=DRV1_DIG_MOD GND=GND GND_24V=GND_24V MEAS_CUR=DRV1_CUR ON/OFF=DRV1_ON OVERCUR=DRV1_ERR1 OVERHEAT=DRV1_ERR2
A8: designators end in A8; ports +3.3V=+3.3V +5VA=+5VA +24V=+24V AGND=AGND AN_MOD=DRV2_AN_MOD DIG_MOD=DRV2_DIG_MOD GND=GND GND_24V=GND_24V MEAS_CUR=DRV2_CUR ON/OFF=DRV2_ON OVERCUR=DRV2_ERR1 OVERHEAT=DRV2_ERR2

### Notes on the sheet
- ON/OFF
- +12V
- GND
- AN_MOD
- DIG_MOD
- OVERHEAT
- (near XP5) MEASURED CURRENT
- OVERCURRENT
- Подп. и дата
- Инв. № дубл.
- Взам. инв. №
- Инв. № подл.
- Изм.
- Лист
- № докум.
- Подп.
- Дата
- Копировал
- Формат А3
- (in symbol Connector-8) Конт.; Цепь
- (in symbol LD2981ABU50TR) *STU
- (in symbol TMU3) DC/DC

### Library data of the parts
C51 = Capacitor_Polar: Model: TECAP, 10 мкФ, 35 В, тип C, 10%; Value: 10мкФх35B; Document: *; Manufacturer: *
C52 C53 = Capacitor: as C7 on sheet Main; Value: 1мкФ; Document: *
C54 C56 C58-C60 C63-C65 C67 C68 C70 C71 = Capacitor: as C3 on sheet Main; Value: 0,1мкФ; Document: *
C55 C61 C69 = Capacitor: as C98 on sheet Hardwiring; Value: 100пФ; Document: *
C57 = Capacitor_Polar: Model: TECAP, 10 мкФ, 25 В, тип B, 10%; Value: 10мкФх25B; Document: *; Manufacturer: *
C62 = Capacitor: as C111 on sheet Hardwiring; Value: 0,33мкФ; Document: *
C66 = Capacitor: as C44 on sheet Power_supply; Value: 10нФ; Document: *
DA9 = TMU3: Manufacturer: Traco Power; Model: TMU 3-2412; Document: *
DA10 = LD2981ABU50TR: Manufacturer: STMicroelectronics; Model: L78L05ABUTR; Document: *
DA11 DA12 = LMC7101: Manufacturer: Texas Instruments; Model: LMC7101BIM5; Document: *
DD7 DD8 = SN74LVC1G17: Manufacturer: Texas Instruments; Model: SN74LVC1G17DBV; Document: *
DD9 = ADUM1400: Manufacturer: Analog Devices; Model: ADUM1400CRW; Document: *
DD10 = ADUM1200: Manufacturer: Analog Devices; Model: ADUM1200CR; Document: *
R31 R32 R34-R39 R41 R43 = Resistor: as R6 on sheet Main; Value: 10к; Document: *
R33 = Resistor: Manufacturer: Yageo; Model: RC0603FR-0715KL; Value: 15к; Document: *
R40 R42 = Resistor: as R97 on sheet Hardwiring; Value: 16,5к; Document: *
U1 = ACPL-C87: Manufacturer: Broadcom; Model: ACPL-C87A-500E
XP5 = Connector-8: Manufacturer: JST; Model: B8B-PHDSS; Document: *

## Sheet Guide_laser.SchDoc
size 420 x 297 mm; Address1: Address1; Address2: Address2; Address3: Address3; Address4: Address4; DocumentNumber: *Э3; SheetNumber: 6; SheetTotal: 11; DocumentType: Схема электрическая *
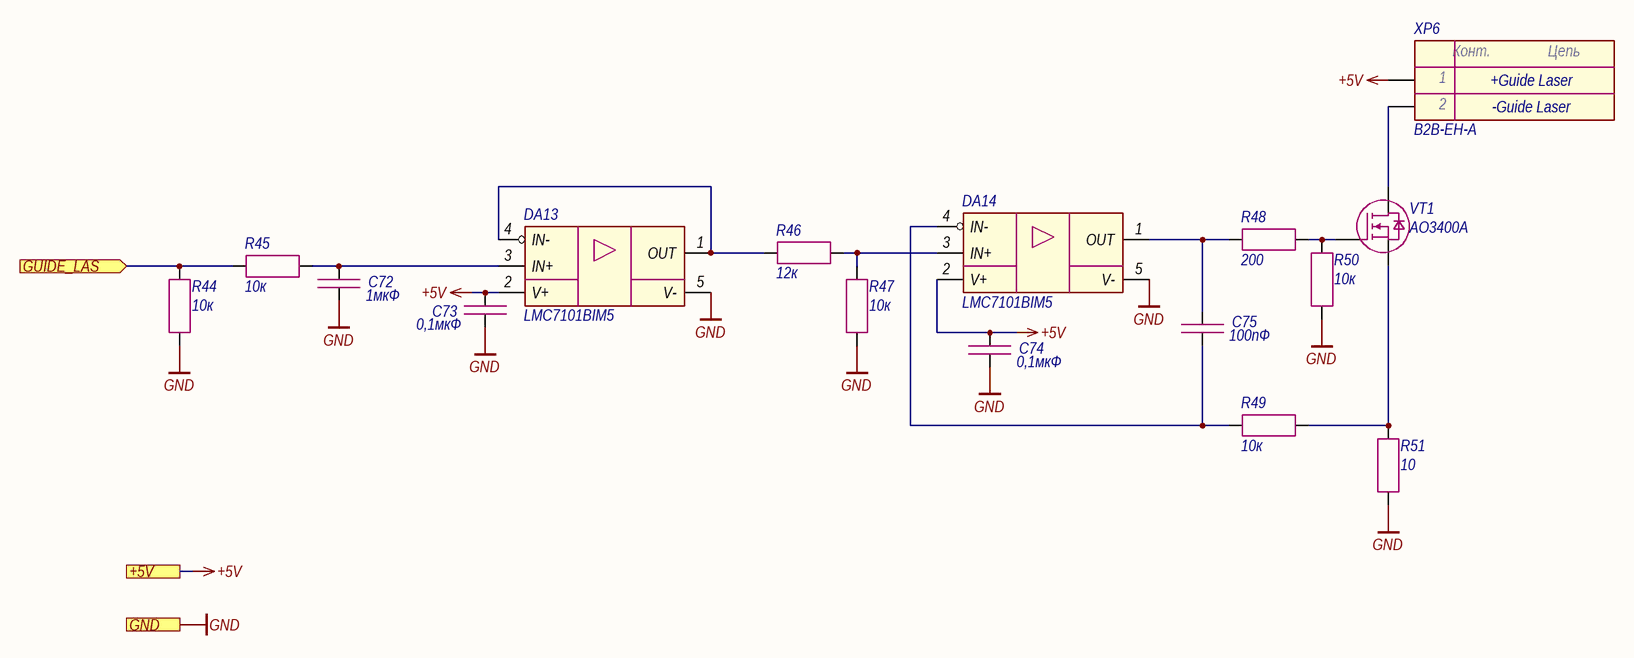
[diagram p8: Guide_laser.SchDoc]

### Parts
C72  1мкФ  [CAP_0603]
C73  0,1мкФ  [CAP_0603]
C74  0,1мкФ  [CAP_0603]
C75  100пФ  [CAP_0603]
DA13  LMC7101BIM5  [SOT-23-5]
DA14  LMC7101BIM5  [SOT-23-5]
R44  10к  [RES_0603]
R45  10к  [RES_0603]
R46  12к  [RES_0603]
R47  10к  [RES_0603]
R48  200  [RES_0603]
R49  10к  [RES_0603]
R50  10к  [RES_0603]
R51  10  [RES_1210]
VT1  AO3400A  [SOT-23-3]
XP6  B2B-EH-A  [B2B-EH-A]

### Ports
+5V (see Main[2A]), GND (see Main[2A], Ethernet[3D], Fiber_interlock[2C], Flow_sensor[2C], Hardwiring[3D], Indication[1C], LD_driver[1D], Power_supply[1D]), GUIDE_LAS (in, see Main[3A])

### Nets
+5V: C73.1 C74.1 DA13.2(V+) DA14.2(V+) XP6.1 ; port +5V
GND: C72.2 C73.2 C74.2 DA13.5(V-) DA14.5(V-) R44.1 R47.2 R50.1 R51.1 ; port GND
GUIDE_LAS: R44.2 R45.1 ; port GUIDE_LAS
NetC72_1: C72.1 DA13.3(IN+) R45.2
NetC75_1: C75.1 DA14.1(OUT) R48.1
NetC75_2: C75.2 DA14.4(IN-) R49.1
NetDA13_1: DA13.1(OUT) DA13.4(IN-) R46.1
NetDA14_3: DA14.3(IN+) R46.2 R47.1
NetR48_2: R48.2 R50.2 VT1.1(G)
NetR49_2: R49.2 R51.2 VT1.2(S)
NetVT1_3: VT1.3(D) XP6.2

### Notes on the sheet
- +Guide Laser
- -Guide Laser
- Подп. и дата
- Инв. № дубл.
- Взам. инв. №
- Инв. № подл.
- Изм.
- Лист
- № докум.
- Подп.
- Дата
- Копировал
- Формат А3
- (in symbol Connector-2) Конт.; Цепь

### Library data of the parts
C72 = Capacitor: as C7 on sheet Main; Value: 1мкФ; Document: *
C73 C74 = Capacitor: as C3 on sheet Main; Value: 0,1мкФ; Document: *
C75 = Capacitor: as C98 on sheet Hardwiring; Value: 100пФ; Document: *
DA13 DA14 = LMC7101: Manufacturer: Texas Instruments; Model: LMC7101BIM5; Document: *
R44 R45 R47 R49 R50 = Resistor: as R6 on sheet Main; Value: 10к; Document: *
R46 = Resistor: as R69 on sheet Ethernet; Value: 12к; Document: *
R48 = Resistor: as R8 on sheet Main; Value: 200; Document: *
R51 = Resistor: Manufacturer: Yageo; Model: RC1210FR-0710RL; Value: 10; Document: *
VT1 = MOSFET N-channel: Manufacturer: UMW; Model: AO3400A; Document: *
XP6 = Connector-2: Manufacturer: JST; Model: B2B-EH-A; Document: *

## Sheet Fiber_interlock.SchDoc
size 420 x 297 mm; Address1: Address1; Address2: Address2; Address3: Address3; Address4: Address4; DocumentNumber: *Э3; SheetNumber: 8; SheetTotal: 11; DocumentType: Схема электрическая *
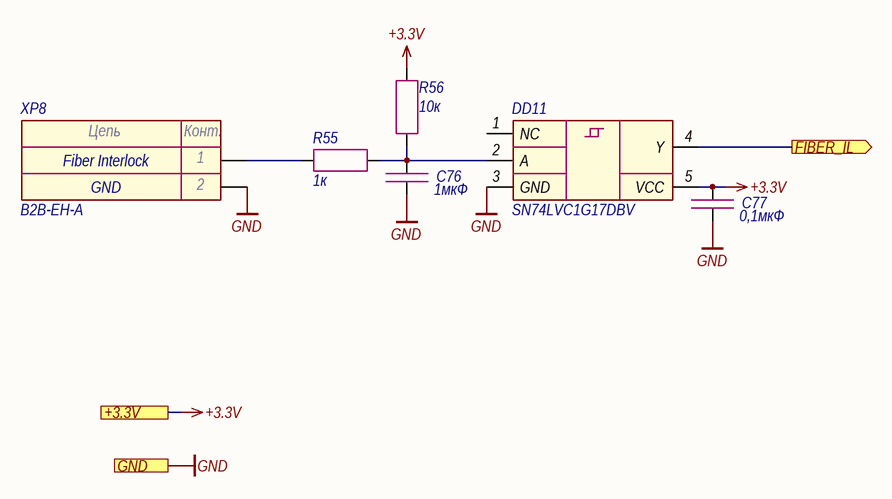
[diagram p9: Fiber_interlock.SchDoc]

### Parts
C76  1мкФ  [CAP_0603]
C77  0,1мкФ  [CAP_0603]
DD11  SN74LVC1G17DBV  [SOT-23-5]
R55  1к  [RES_0603]
R56  10к  [RES_0603]
XP8  B2B-EH-A  [B2B-EH-A]

### Ports
+3.3V (see Main[2A], Ethernet[3D], Flow_sensor[2C], Hardwiring[3D], LD_driver[1D], Power_supply[1D]), FIBER_IL (out, see Main[3A]), GND (see Main[2A], Ethernet[3D], Flow_sensor[2C], Guide_laser[1C], Hardwiring[3D], Indication[1C], LD_driver[1D], Power_supply[1D])

### Nets
+3.3V: C77.1 DD11.5(VCC) R56.2 ; port +3.3V
GND: C76.2 C77.2 DD11.3(GND) XP8.2 ; port GND
FIBER_IL: DD11.4(Y) ; port FIBER_IL
NetC76_1: C76.1 DD11.2(A) R55.2 R56.1
NetR55_1: R55.1 XP8.1

Not connected (* = marked no-connect by the designer): DD11 1(NC)

### Notes on the sheet
- (near XP8) Fiber Interlock
- GND
- Подп. и дата
- Инв. № дубл.
- Взам. инв. №
- Инв. № подл.
- Изм.
- Лист
- № докум.
- Подп.
- Дата
- Копировал
- Формат А3
- (in symbol Connector-2) Цепь; Конт.

### Library data of the parts
C76 = Capacitor: as C7 on sheet Main; Value: 1мкФ; Document: *
C77 = Capacitor: as C3 on sheet Main; Value: 0,1мкФ; Document: *
DD11 = SN74LVC1G17: Manufacturer: Texas Instruments; Model: SN74LVC1G17DBV; Document: *
R55 = Resistor: as R63 on sheet Ethernet; Value: 1к; Document: *
R56 = Resistor: as R6 on sheet Main; Value: 10к; Document: *
XP8 = Connector-2: Manufacturer: JST; Model: B2B-EH-A; Document: *

## Sheet Flow_sensor.SchDoc
size 420 x 297 mm; Address1: Address1; Address2: Address2; Address3: Address3; Address4: Address4; DocumentNumber: *Э3; SheetNumber: 11; SheetTotal: 11; DocumentType: Схема электрическая *
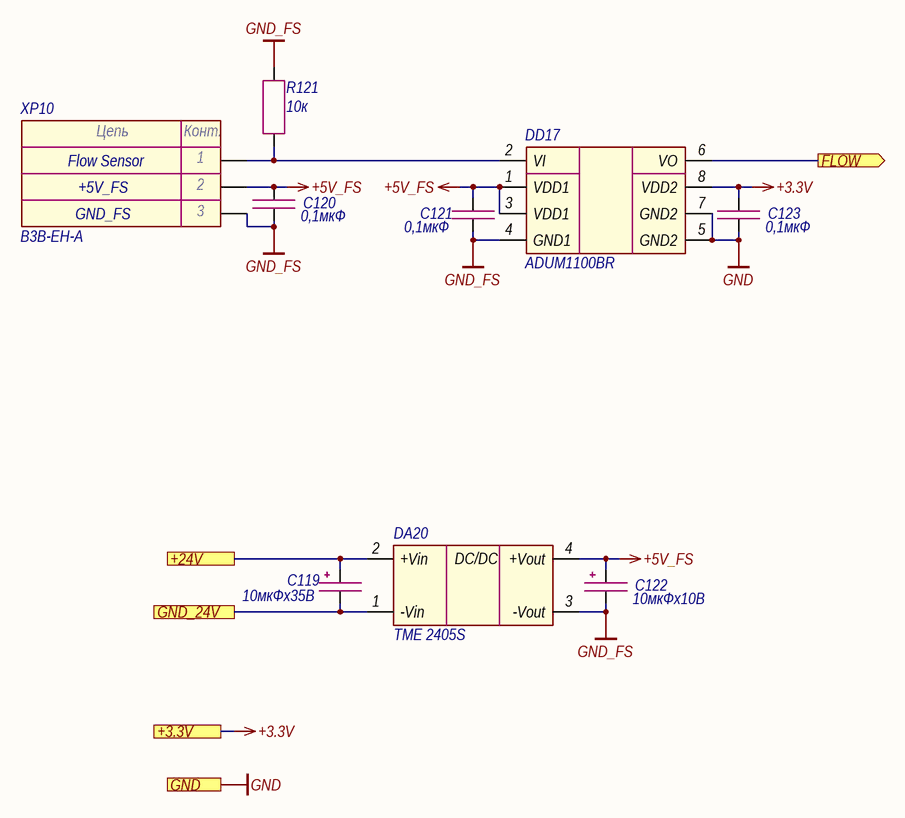
[diagram p10: Flow_sensor.SchDoc]

### Parts
C119  10мкФх35B  [CAP_C]
C120  0,1мкФ  [CAP_0603]
C121  0,1мкФ  [CAP_0603]
C122  10мкФх10B  [CAP_A]
C123  0,1мкФ  [CAP_0603]
DA20  TME 2405S  [TME (SIP-4)]
DD17  ADUM1100BR  [SOIC-8]
R121  10к  [RES_0603]
XP10  B3B-EH-A  [B3B-EH-A]

### Ports
+3.3V (see Main[3C], Ethernet[3D], Fiber_interlock[2C], Hardwiring[3D], LD_driver[1D], Power_supply[1D]), +24V (see Main[2C], Hardwiring[3C], Indication[1C], LD_driver[1D], Power_supply[1D]), FLOW (out, see Main[3C]), GND (see Main[3C], Ethernet[3D], Fiber_interlock[2C], Guide_laser[1C], Hardwiring[3D], Indication[1C], LD_driver[1D], Power_supply[1D]), GND_24V (see Main[2C], Hardwiring[3C], Indication[1C], LD_driver[1D], Power_supply[1D])

### Nets
+3.3V: C123.1 DD17.8(VDD2) ; port +3.3V
+5V_FS: C120.1 C121.1 C122.1 DA20.4(+Vout) DD17.1(VDD1) DD17.3(VDD1) XP10.2
+24V: C119.1 DA20.2(+Vin) ; port +24V
GND: C123.2 DD17.5(GND2) DD17.7(GND2) ; port GND
GND_24V: C119.2 DA20.1(-Vin) ; port GND_24V
GND_FS: C120.2 C121.2 C122.2 DA20.3(-Vout) DD17.4(GND1) R121.2 XP10.3
FLOW: DD17.6(VO) ; port FLOW
NetDD17_2: DD17.2(VI) R121.1 XP10.1

### Notes on the sheet
- +5V_FS
- Flow Sensor
- GND_FS
- Подп. и дата
- Инв. № дубл.
- Взам. инв. №
- Инв. № подл.
- Изм.
- Лист
- № докум.
- Подп.
- Дата
- Копировал
- Формат А3
- (in symbol Connector-3) Цепь; Конт.
- (in symbol TME) DC/DC

### Library data of the parts
C119 = Capacitor_Polar: Model: TECAP, 10 мкФ, 35 В, тип C, 10%; Value: 10мкФх35B; Document: *; Manufacturer: *
C120 C121 C123 = Capacitor: as C3 on sheet Main; Value: 0,1мкФ; Document: *
C122 = Capacitor_Polar: Model: TECAP, 10 мкФ, 10 В, тип A, 10%; Value: 10мкФх10B; Document: *; Manufacturer: *
DA20 = TME: Manufacturer: Traco Power; Model: TME 2405S; Document: *
DD17 = ADUM1100: Manufacturer: Analog Devices; Model: ADUM1100BR; Document: *
R121 = Resistor: as R6 on sheet Main; Value: 10к; Document: *
XP10 = Connector-3: Manufacturer: JST; Model: B3B-EH-A; Document: *